# EAGLE design AQ_sensor_GSM (EAGLE 9.6.2)

## Sheet 1 of 6: Control Board
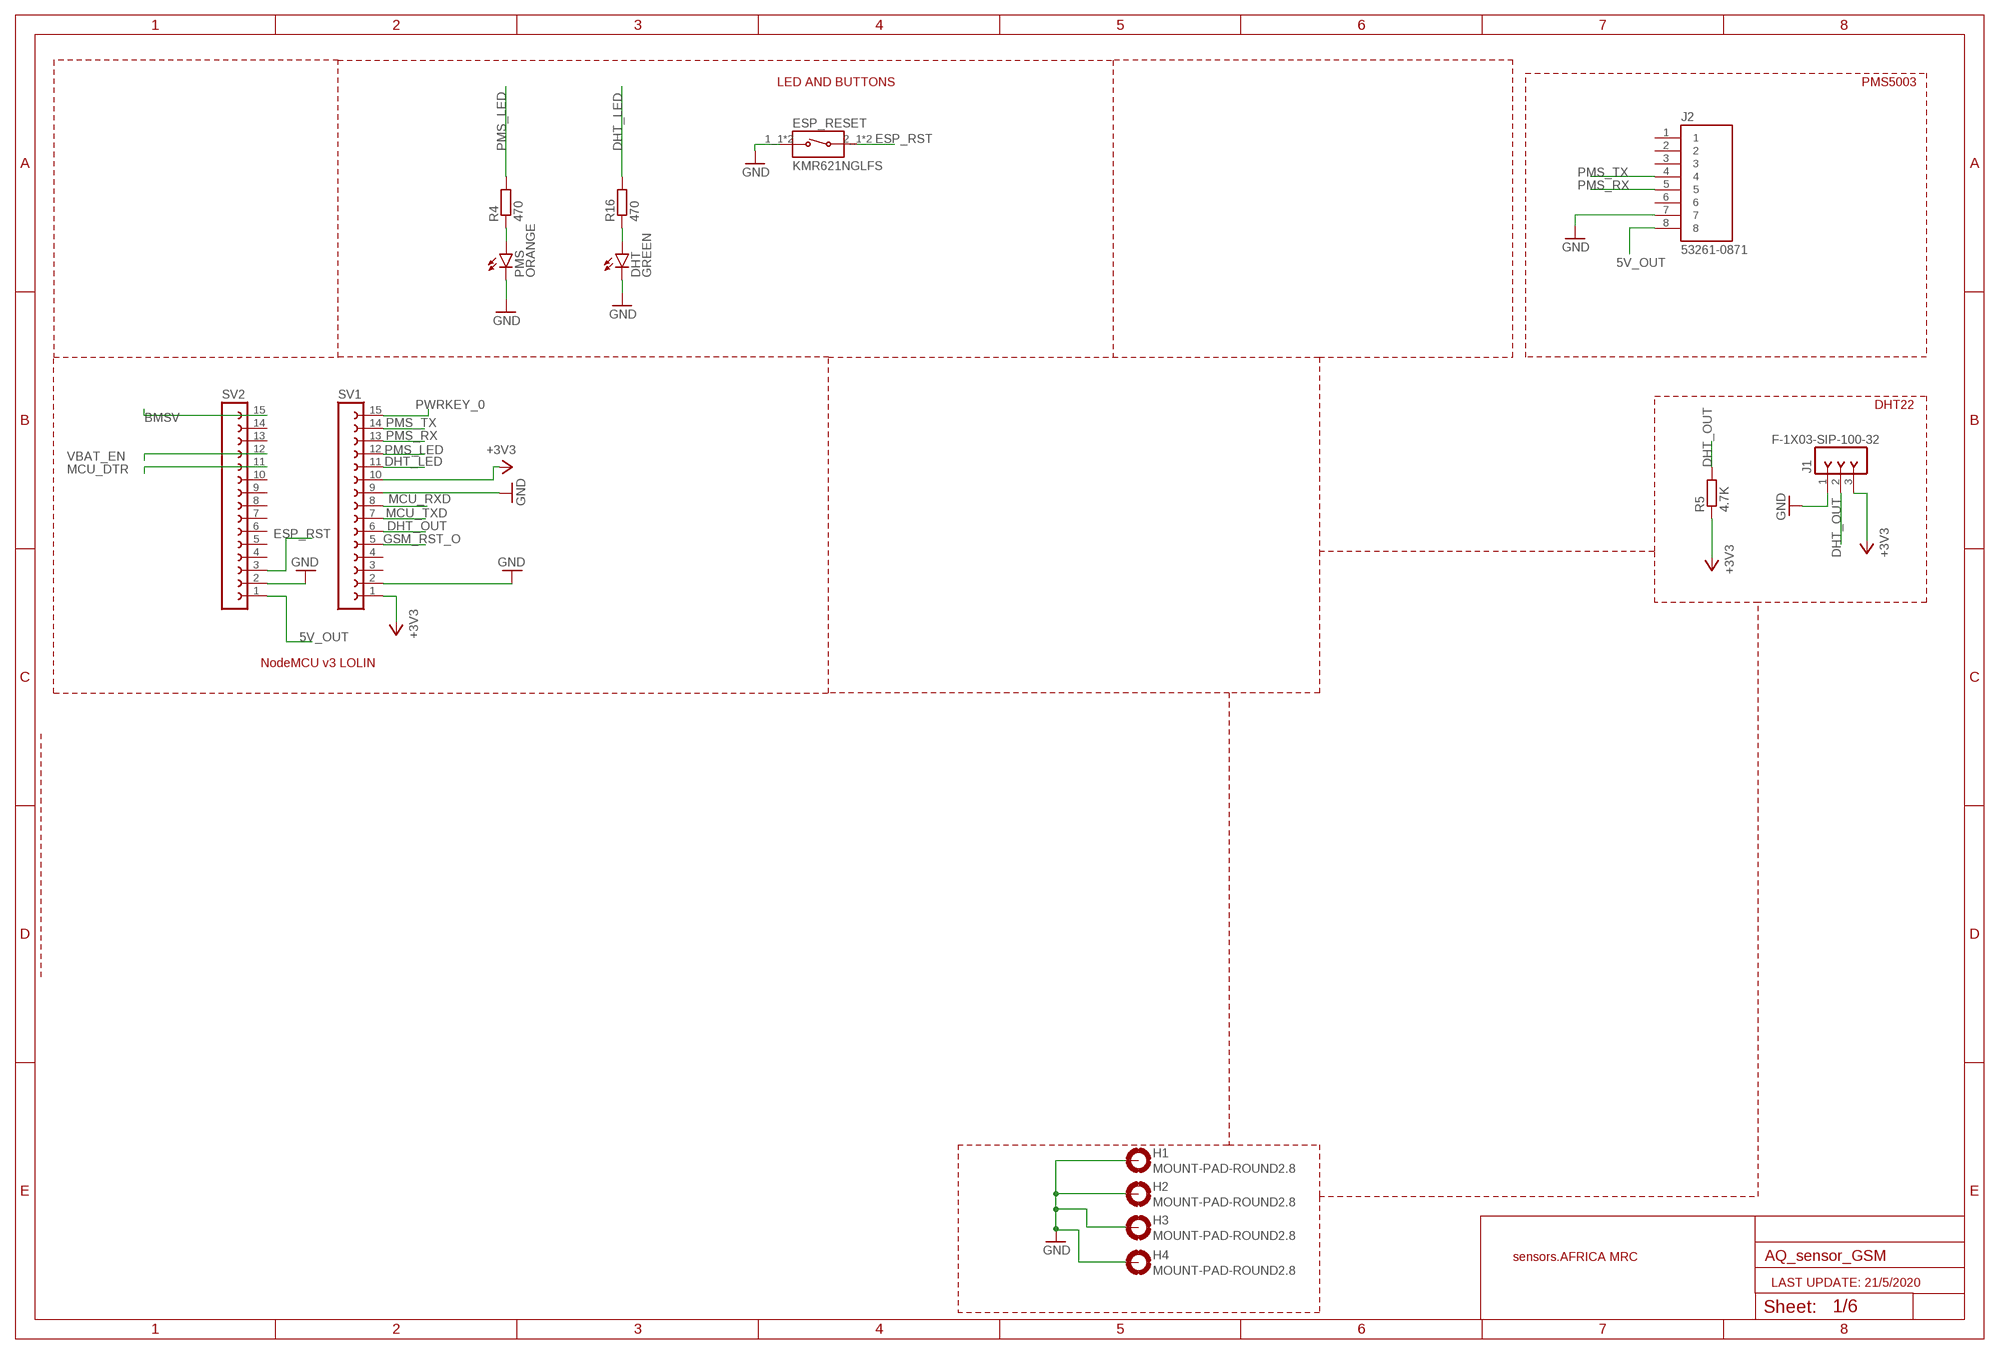
[diagram p0: schematic, sheet 1]

### Parts
DHT  GREEN  LEDCHIP-LED0603  [CHIP-LED0603]
ESP_RESET  KMR621NGLFS  [SW_KMR621NGLFS]
H1  MOUNT-PAD-ROUND2.8  [2,8-PAD]
H2  MOUNT-PAD-ROUND2.8  [2,8-PAD]
H3  MOUNT-PAD-ROUND2.8  [2,8-PAD]
H4  MOUNT-PAD-ROUND2.8  [2,8-PAD]
J1  F-1X03-SIP-100-32  [SIP-100-03-32]
J2  53261-0871  [MOLEX_53261-0871]
PMS  ORANGE  LEDCHIP-LED0603  [CHIP-LED0603]
R4  470  R-EU_R0603  [R0603]
R5  4.7K  R-EU_R0603  [R0603]
R16  470  R-EU_R0603  [R0603]
SV1  FE15-1  [FE15]
SV2  FE15-1  [FE15]

### Nets
5V_OUT [HCurrent]: J2.8 SV2.1 ; also sheet 4
+3V3 [POWER]: J1.3 R5.1 SV1.1 SV1.10 ; also sheet 2,4
BMSV: SV2.15 ; also sheet 4
DHT_LED: R16.2 SV1.11
DHT_OUT: J1.2 R5.2 SV1.6
ESP_RST: ESP_RESET.2_1 ESP_RESET.2_2 SV2.3
GND: DHT.C ESP_RESET.1_1 ESP_RESET.1_2 H1.B2,8(MOUNT) H2.B2,8(MOUNT) H3.B2,8(MOUNT) H4.B2,8(MOUNT) J1.1 J2.7 PMS.C SV1.2 SV1.9 SV2.2 ; also sheet 2,3,4,5
GSM_RST_O: SV1.5 ; also sheet 2
MCU_DTR: SV2.11 ; also sheet 2
MCU_RXD: SV1.8 ; also sheet 2,3
MCU_TXD: SV1.7 ; also sheet 2,3
N$4: PMS.A R4.1
N$27: DHT.A R16.1
PMS_LED: R4.2 SV1.12
PMS_RX: J2.5 SV1.13
PMS_TX: J2.4 SV1.14
PWRKEY_0: SV1.15 ; also sheet 2
VBAT_EN: SV2.12
Unconnected: J2.1 J2.2 J2.3 J2.6 SV1.3 SV1.4 SV2.4 SV2.5 SV2.6 SV2.7 SV2.8 SV2.9 SV2.10 SV2.13 SV2.14

### Notes on the sheet
- LED AND BUTTONS | PMS5003
- DHT22
- NodeMCU v3 LOLIN
- sensors.AFRICA MRC
- LAST UPDATE: 21/5/2020

## Sheet 2 of 6: Protection and Logic Level Converters
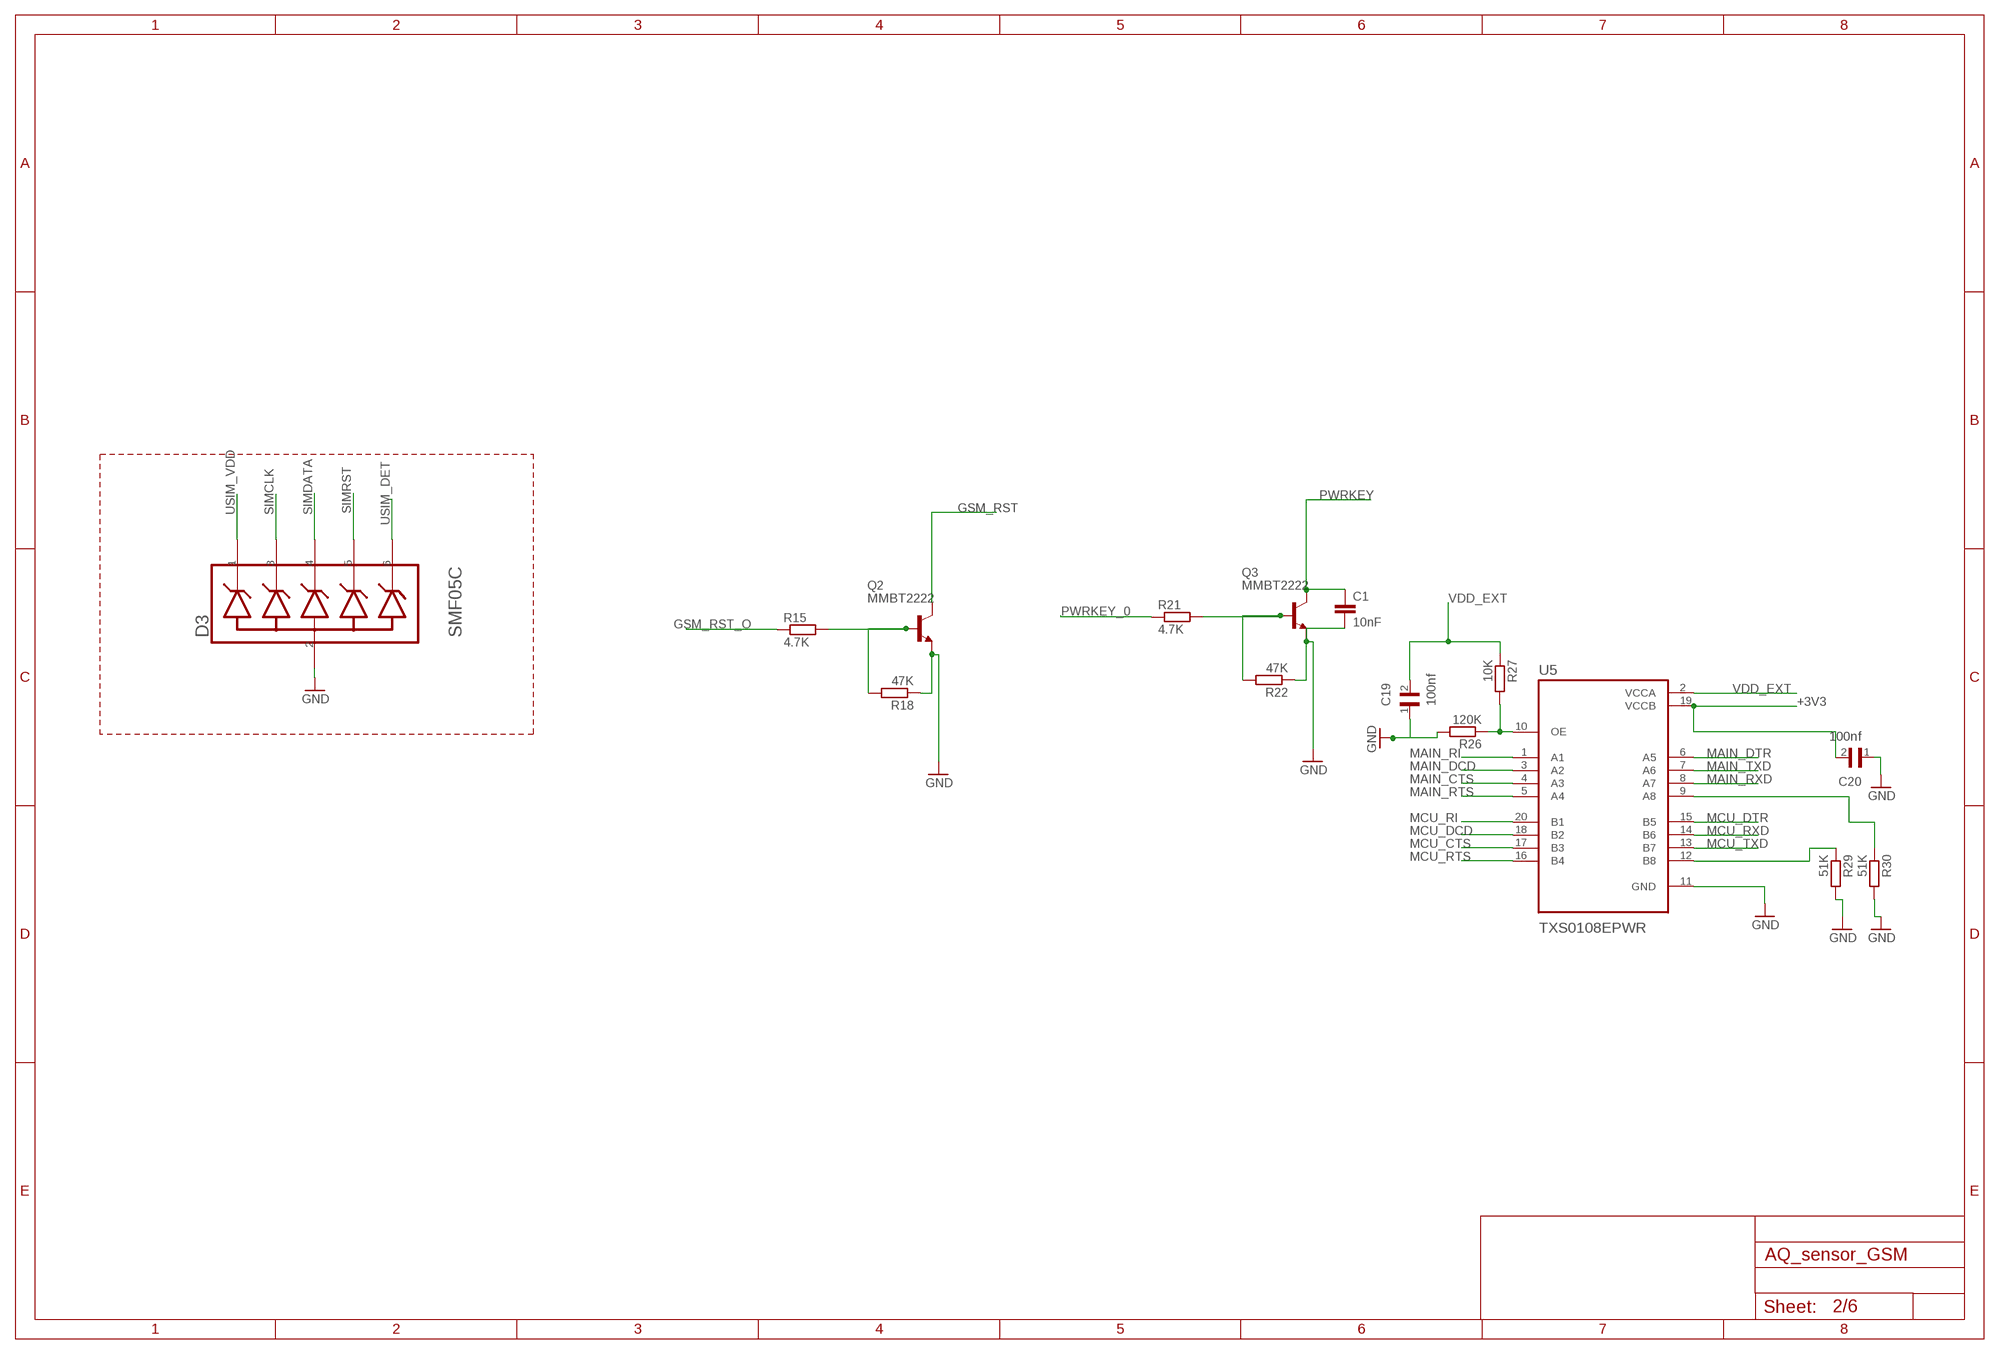
[diagram p1: schematic, sheet 2]

### Parts
C1  10nF  10NF-0603-50V-10%  [0603]
C19  100nf  06035C104K4T2A  [CAPC1608X90N]
C20  100nf  06035C104K4T2A  [CAPC1608X90N]
D3  SEMTECH_SMF05CSEMTECH_SMF05C_0_0  [SEMTECH_SMF05C_0]
Q2  MMBT2222  [SOT23-BEC]
Q3  MMBT2222  [SOT23-BEC]
R15  4.7K  R-EU_R0603  [R0603]
R18  47K  R-EU_R0603  [R0603]
R21  4.7K  R-EU_R0603  [R0603]
R22  47K  R-EU_R0603  [R0603]
R26  120K  R-EU_R0603  [R0603]
R27  10K  R-EU_R0603  [R0603]
R29  51K  R-EU_R0603  [R0603]
R30  51K  R-EU_R0603  [R0603]
U5  TXS0108EPWR  [SOP65P640X120-20N]

### Nets
+3V3 [POWER]: C20.2 U5.19(VCCB) ; also sheet 1,4
GND: C1.2 C19.1 C20.1 D3.2(ANODE) Q2.E Q3.E R18.1 R22.1 R26.2 R29.2 R30.2 U5.11(GND) ; also sheet 1,3,4,5
GSM_RST [BGA]: Q2.C ; also sheet 3,5
GSM_RST_O: R15.1 ; also sheet 1
MAIN_CTS: U5.4(A3) ; also sheet 3
MAIN_DCD: U5.3(A2) ; also sheet 3
MAIN_DTR: U5.6(A5) ; also sheet 3
MAIN_RI [BGA]: U5.1(A1) ; also sheet 3,5
MAIN_RTS: U5.5(A4) ; also sheet 3
MAIN_RXD: U5.8(A7) ; also sheet 3
MAIN_TXD: U5.7(A6) ; also sheet 3
MCU_CTS: U5.17(B3)
MCU_DCD: U5.18(B2)
MCU_DTR: U5.15(B5) ; also sheet 1
MCU_RI: U5.20(B1)
MCU_RTS: U5.16(B4)
MCU_RXD: U5.14(B6) ; also sheet 1,3
MCU_TXD: U5.13(B7) ; also sheet 1,3
N$1: Q2.B R15.2 R18.2
N$2: Q3.B R21.2 R22.2
N$31: R26.1 R27.2 U5.10(OE)
N$40: R30.1 U5.9(A8)
N$41: R29.1 U5.12(B8)
PWRKEY [BGA]: C1.1 Q3.C ; also sheet 3
PWRKEY_0: R21.1 ; also sheet 1
SIMCLK [BGA]: D3.3(2_CATHODE) ; also sheet 3
SIMDATA: D3.4(3_CATHODE) ; also sheet 3
SIMRST: D3.5(4_CATHODE) ; also sheet 3
USIM_DET: D3.6(5_CATHODE) ; also sheet 3
USIM_VDD: D3.1(1_CATHODE) ; also sheet 3
VDD_EXT: C19.2 R27.1 U5.2(VCCA) ; also sheet 3

## Sheet 3 of 6: GSM
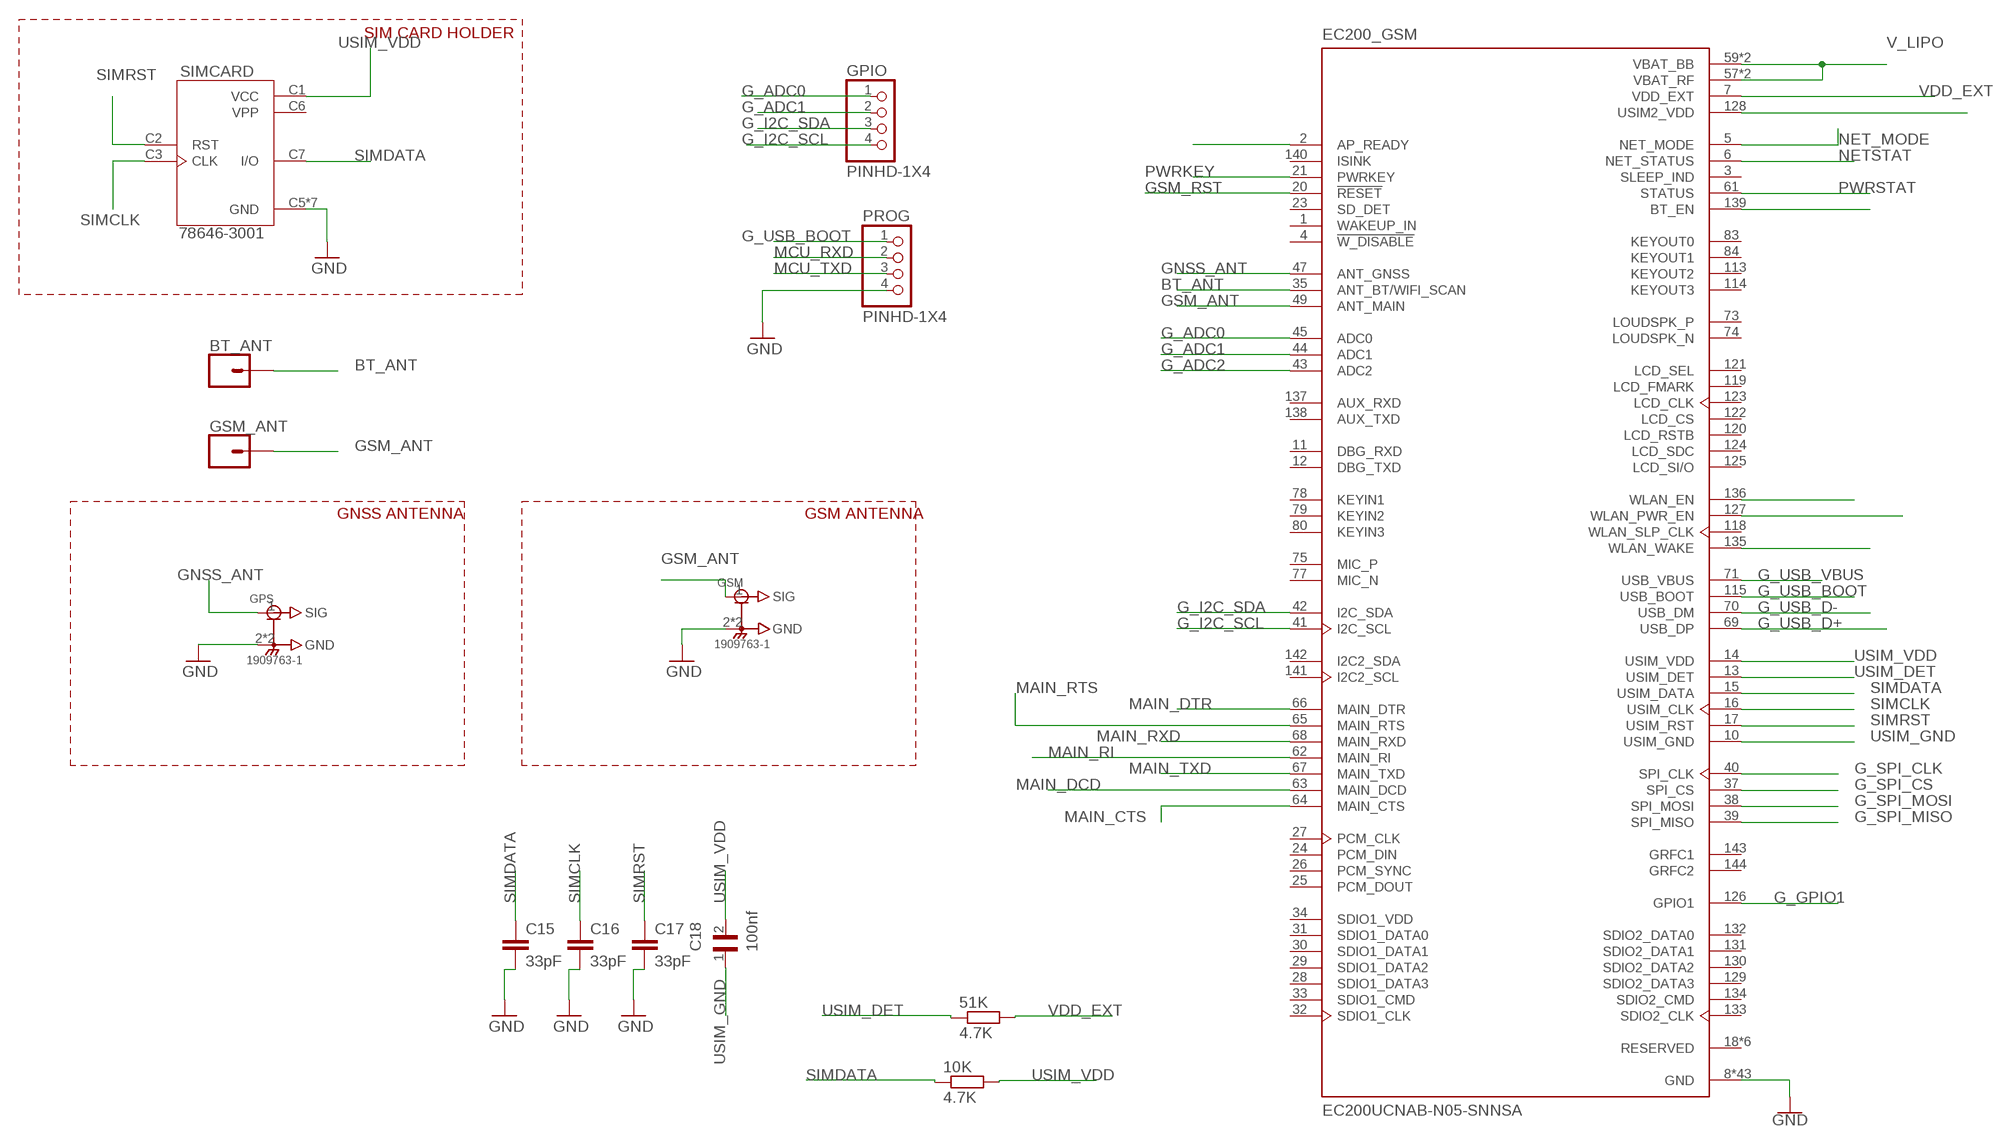
[diagram p2: schematic, sheet 3]

### Parts
10K  4.7K  R-EU_R0603  [R0603]
51K  4.7K  R-EU_R0603  [R0603]
BT_ANT  CONN_01  [1X01]
C15  33pF  C-EUC0603  [C0603]
C16  33pF  C-EUC0603  [C0603]
C17  33pF  C-EUC0603  [C0603]
C18  100nf  06035C104K4T2A  [CAPC1608X90N]
EC200_GSM  EC200UCNAB-N05-SNNSA  [XCVR_EC200UCNAB-N05-SNNSA]
GPIO  PINHD-1X4  [1X04]
GPS  1909763-1  [TE_1909763-1]
GSM  1909763-1  [TE_1909763-1]
GSM_ANT  CONN_01  [1X01]
PROG  PINHD-1X4  [1X04]
SIMCARD  78646-3001  [MOLEX_78646-3001]

### Nets
BT_ANT [HCurrent]: BT_ANT.1 EC200_GSM.35(ANT_BT/WIFI_SCAN)
G_ADC0: EC200_GSM.45(ADC0) GPIO.1
G_ADC1: EC200_GSM.44(ADC1) GPIO.2
G_ADC2: EC200_GSM.43(ADC2)
G_GPIO1: EC200_GSM.126(GPIO1)
G_I2C_SCL: EC200_GSM.41(I2C_SCL) GPIO.4
G_I2C_SDA: EC200_GSM.42(I2C_SDA) GPIO.3
G_SPI_CLK: EC200_GSM.40(SPI_CLK)
G_SPI_CS: EC200_GSM.37(SPI_CS)
G_SPI_MISO: EC200_GSM.39(SPI_MISO)
G_SPI_MOSI: EC200_GSM.38(SPI_MOSI)
G_USB_BOOT: EC200_GSM.115(USB_BOOT) PROG.1
G_USB_D+: EC200_GSM.69(USB_DP) ; also sheet 4
G_USB_D-: EC200_GSM.70(USB_DM) ; also sheet 4
G_USB_VBUS: EC200_GSM.71(USB_VBUS)
GND: C15.2 C16.2 C17.2 EC200_GSM.8(GND) EC200_GSM.9(GND) EC200_GSM.19(GND) EC200_GSM.22(GND) EC200_GSM.36(GND) EC200_GSM.46(GND) EC200_GSM.48(GND) EC200_GSM.50(GND) EC200_GSM.51(GND) EC200_GSM.52(GND) EC200_GSM.53(GND) EC200_GSM.54(GND) EC200_GSM.56(GND) EC200_GSM.72(GND) EC200_GSM.76(GND) EC200_GSM.85(GND) EC200_GSM.86(GND) EC200_GSM.87(GND) EC200_GSM.88(GND) EC200_GSM.89(GND) EC200_GSM.90(GND) EC200_GSM.91(GND) EC200_GSM.92(GND) EC200_GSM.93(GND) EC200_GSM.94(GND) EC200_GSM.95(GND) EC200_GSM.96(GND) EC200_GSM.97(GND) EC200_GSM.98(GND) EC200_GSM.99(GND) EC200_GSM.100(GND) EC200_GSM.101(GND) EC200_GSM.102(GND) EC200_GSM.103(GND) EC200_GSM.104(GND) EC200_GSM.105(GND) EC200_GSM.106(GND) EC200_GSM.107(GND) EC200_GSM.108(GND) EC200_GSM.109(GND) EC200_GSM.110(GND) EC200_GSM.111(GND) EC200_GSM.112(GND) GPS.2(GND) GPS.3(GND) GSM.2(GND) GSM.3(GND) PROG.4 SIMCARD.C5(GND) SIMCARD.G1(GND) SIMCARD.G2(GND) SIMCARD.G3(GND) SIMCARD.G4(GND) SIMCARD.G5(GND) SIMCARD.G6(GND) ; also sheet 1,2,4,5
GNSS_ANT [HCurrent]: EC200_GSM.47(ANT_GNSS) GPS.1(SIG)
GSM_ANT [HCurrent]: EC200_GSM.49(ANT_MAIN) GSM.1(SIG) GSM_ANT.1
GSM_RST [BGA]: EC200_GSM.20(!RESET) ; also sheet 2,5
MAIN_CTS: EC200_GSM.64(MAIN_CTS) ; also sheet 2
MAIN_DCD: EC200_GSM.63(MAIN_DCD) ; also sheet 2
MAIN_DTR: EC200_GSM.66(MAIN_DTR) ; also sheet 2
MAIN_RI [BGA]: EC200_GSM.62(MAIN_RI) ; also sheet 2,5
MAIN_RTS: EC200_GSM.65(MAIN_RTS) ; also sheet 2
MAIN_RXD: EC200_GSM.68(MAIN_RXD) ; also sheet 2
MAIN_TXD: EC200_GSM.67(MAIN_TXD) ; also sheet 2
MCU_RXD: PROG.2 ; also sheet 1,2
MCU_TXD: PROG.3 ; also sheet 1,2
N$5: EC200_GSM.128(USIM2_VDD)
N$7: EC200_GSM.139(BT_EN)
N$8: EC200_GSM.136(WLAN_EN)
N$15: EC200_GSM.127(WLAN_PWR_EN)
N$16: EC200_GSM.135(WLAN_WAKE)
N$23: EC200_GSM.2(AP_READY)
NET_MODE: EC200_GSM.5(NET_MODE) ; also sheet 5
NETSTAT [BGA]: EC200_GSM.6(NET_STATUS) ; also sheet 5
PWRKEY [BGA]: EC200_GSM.21(PWRKEY) ; also sheet 2
PWRSTAT: EC200_GSM.61(STATUS) ; also sheet 5
SIMCLK [BGA]: C16.1 EC200_GSM.16(USIM_CLK) SIMCARD.C3(CLK) ; also sheet 2
SIMDATA: 10K.1 C15.1 EC200_GSM.15(USIM_DATA) SIMCARD.C7(I/O) ; also sheet 2
SIMRST: C17.1 EC200_GSM.17(USIM_RST) SIMCARD.C2(RST) ; also sheet 2
USIM_DET: 51K.1 EC200_GSM.13(USIM_DET) ; also sheet 2
USIM_GND: C18.1 EC200_GSM.10(USIM_GND)
USIM_VDD: 10K.2 C18.2 EC200_GSM.14(USIM_VDD) SIMCARD.C1(VCC) ; also sheet 2
V_LIPO [HCurrent]: EC200_GSM.57(VBAT_RF) EC200_GSM.58(VBAT_RF) EC200_GSM.59(VBAT_BB) EC200_GSM.60(VBAT_BB) ; also sheet 4,5
VDD_EXT: 51K.2 EC200_GSM.7(VDD_EXT) ; also sheet 2
Unconnected: EC200_GSM.1(WAKEUP_IN) EC200_GSM.3(SLEEP_IND) EC200_GSM.4(!W_DISABLE) EC200_GSM.11(DBG_RXD) EC200_GSM.12(DBG_TXD) EC200_GSM.18(RESERVED) EC200_GSM.23(SD_DET) EC200_GSM.24(PCM_DIN) EC200_GSM.25(PCM_DOUT) EC200_GSM.26(PCM_SYNC) EC200_GSM.27(PCM_CLK) EC200_GSM.28(SDIO1_DATA3) EC200_GSM.29(SDIO1_DATA2) EC200_GSM.30(SDIO1_DATA1) EC200_GSM.31(SDIO1_DATA0) EC200_GSM.32(SDIO1_CLK) EC200_GSM.33(SDIO1_CMD) EC200_GSM.55(RESERVED) EC200_GSM.73(LOUDSPK_P) EC200_GSM.74(LOUDSPK_N) EC200_GSM.75(MIC_P) EC200_GSM.77(MIC_N) EC200_GSM.78(KEYIN1) EC200_GSM.79(KEYIN2) EC200_GSM.80(KEYIN3) EC200_GSM.81(RESERVED) EC200_GSM.82(RESERVED) EC200_GSM.83(KEYOUT0) EC200_GSM.84(KEYOUT1) EC200_GSM.113(KEYOUT2) EC200_GSM.114(KEYOUT3) EC200_GSM.116(RESERVED) EC200_GSM.117(RESERVED) EC200_GSM.118(WLAN_SLP_CLK) EC200_GSM.119(LCD_FMARK) EC200_GSM.120(LCD_RSTB) EC200_GSM.121(LCD_SEL) EC200_GSM.122(LCD_CS) EC200_GSM.123(LCD_CLK) EC200_GSM.124(LCD_SDC) EC200_GSM.125(LCD_SI/O) EC200_GSM.129(SDIO2_DATA3) EC200_GSM.130(SDIO2_DATA2) EC200_GSM.131(SDIO2_DATA1) EC200_GSM.132(SDIO2_DATA0) EC200_GSM.133(SDIO2_CLK) EC200_GSM.134(SDIO2_CMD) EC200_GSM.137(AUX_RXD) EC200_GSM.138(AUX_TXD) EC200_GSM.140(ISINK) EC200_GSM.141(I2C2_SCL) EC200_GSM.142(I2C2_SDA) EC200_GSM.143(GRFC1) EC200_GSM.144(GRFC2)

### Notes on the sheet
- SIM CARD HOLDER
- GNSS ANTENNA | GSM ANTENNA

## Sheet 4 of 6: POWER CIRCUIT
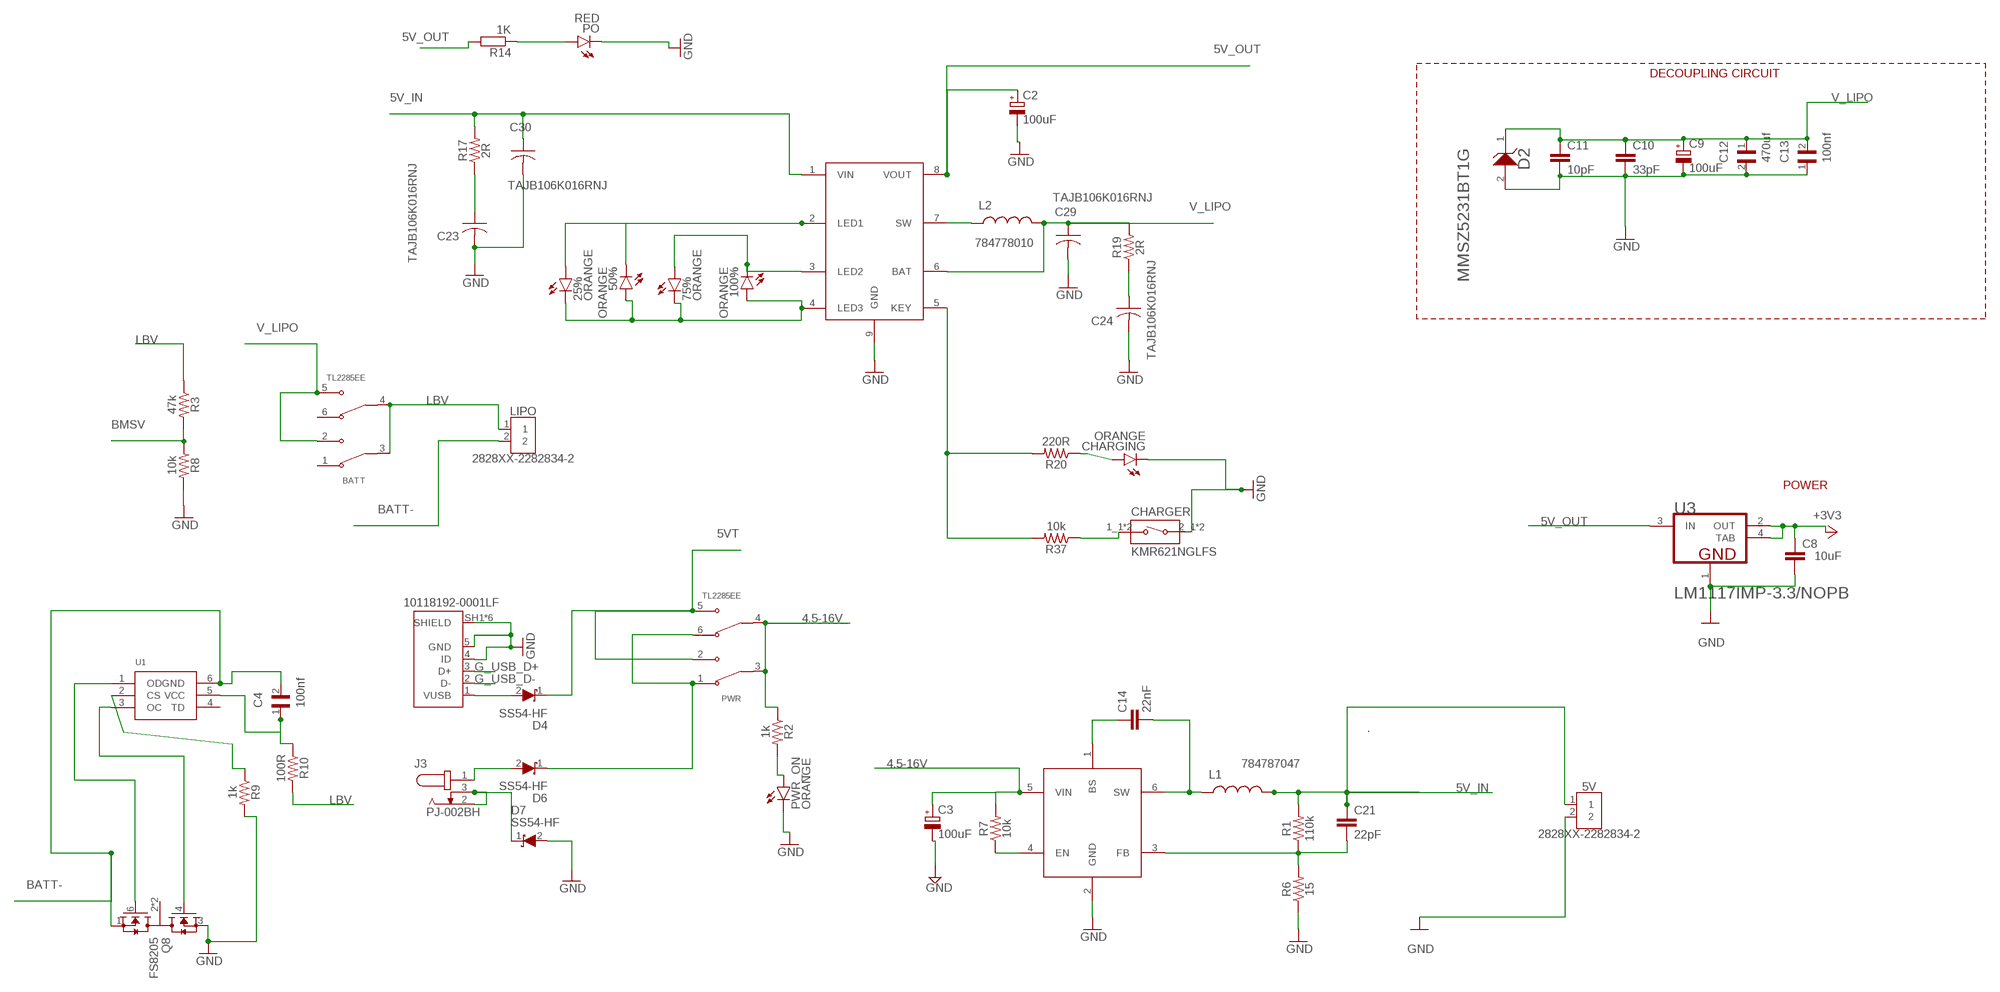
[diagram p3: schematic, sheet 4]

### Parts
5V  2828XX-2282834-2  [TERMBLK_254-2N]
25%  ORANGE  LEDCHIP-LED0603  [CHIP-LED0603]
50%  ORANGE  LEDCHIP-LED0603  [CHIP-LED0603]
75%  ORANGE  LEDCHIP-LED0603  [CHIP-LED0603]
100%  ORANGE  LEDCHIP-LED0603  [CHIP-LED0603]
BATT  TL2285EE  [SW_TL2285EE]
C2  100uF  CPOL-EUD  [PANASONIC_D]
C3  100uF  CPOL-EUD  [PANASONIC_D]
C4  100nf  06035C104K4T2A  [CAPC1608X90N]
C8  10uF  C-EUC0603  [C0603]
C9  100uF  CPOL-EUD  [PANASONIC_D]
C10  33pF  C-EUC0603  [C0603]
C11  10pF  C-EUC0603  [C0603]
C12  470uf  T495X477K010ATE100  [CAPMP7343X430N]
C13  100nf  06035C104K4T2A  [CAPC1608X90N]
C14  22nF  220PF-0402T-50V-5%  [0402-TIGHT]
C21  22pF  220PF-0402T-50V-5%  [0402-TIGHT]
C23  TAJB106K016RNJ  [CAP_TANT_B]
C24  TAJB106K016RNJ  [CAP_TANT_B]
C29  TAJB106K016RNJ  [CAP_TANT_B]
C30  TAJB106K016RNJ  [CAP_TANT_B]
CHARGER  KMR621NGLFS  [SW_KMR621NGLFS]
CHARGING  ORANGE  LEDCHIP-LED0603  [CHIP-LED0603]
D2  ON_SEMICONDUCTOR_MMSZ5231BT1GON_SEMICONDUCTOR_MMSZ5231BT1G_0_0  [ON_SEMICONDUCTOR_MMSZ5231BT1G_0]
D4  SS54-HF  [DIOM5025X220N]
D6  SS54-HF  [DIOM5025X220N]
D7  SS54-HF  [DIOM5025X220N]
J3  PJ-002BH  [CUI_PJ-002BH]
L1  784787047  [784787047]
L2  784778010  [784778010]
LIPO  2828XX-2282834-2  [TERMBLK_254-2N]
MT2492  MT2492  MT2492MT2492  [SOT95P280X145-6N]
PB_IN  10118192-0001LF  [AMPHENOL_10118192-0001LF]
PO  RED  LEDCHIP-LED0603  [CHIP-LED0603]
PWR  TL2285EE  [SW_TL2285EE]
PWR_ON  ORANGE  LEDCHIP-LED0603  [CHIP-LED0603]
Q8  FS8205  [SOT95P280X145-6N]
R1  110k  1.20KOHM-0603-1/10W-1%  [0603]
R2  1k  1.20KOHM-0603-1/10W-1%  [0603]
R3  47k  1.20KOHM-0603-1/10W-1%  [0603]
R6  15  1.20KOHM-0603-1/10W-1%  [0603]
R7  10k  1.20KOHM-0603-1/10W-1%  [0603]
R8  10k  1.20KOHM-0603-1/10W-1%  [0603]
R9  1k  1.20KOHM-0603-1/10W-1%  [0603]
R10  100R  1.20KOHM-0603-1/10W-1%  [0603]
R14  1K  R-EU_R0603  [R0603]
R17  2R  1.20KOHM-0603-1/10W-1%  [0603]
R19  2R  1.20KOHM-0603-1/10W-1%  [0603]
R20  220R  1.20KOHM-0603-1/10W-1%  [0603]
R37  10k  1.20KOHM-0603-1/10W-1%  [0603]
U1  DW01-P  [SOT23-6L]
U3  TEXAS_INSTRUMENTS_LM1117IMP-3.3-NOPBTEXAS_INSTRUMENTS_LM1117IMP-3.3-NOPB_0_0  [TEXAS_INSTRUMENTS_LM1117IMP-3.3-NOPB_0]
U$2  IP5306IP5306  [SOIC127P600X165-9T209N]

### Nets
4.5-16V [HCurrent]: C3.+ MT2492.5(VIN) PWR.3(COM1) PWR.4(COM2) R2.1 R7.2
5V_IN [HCurrent]: 5V.1 C21.1 C30.1 L1.2 R1.2 R17.2 U$2.1(VIN)
5V_OUT [HCurrent]: C2.+ R14.2 U3.3(IN) U$2.8(VOUT) ; also sheet 1
5VT [HCurrent]: D4.1(K) PWR.2(NO1) PWR.5(NO2)
+3V3 [POWER]: C8.1 U3.2(OUT) U3.4(TAB) ; also sheet 1,2
BATT- [HCurrent]: C4.2 LIPO.2 Q8.1(S1) U1.6(GND)
BMSV: R3.2 R8.1 ; also sheet 1
G_USB_D+: PB_IN.3(D+) ; also sheet 3
G_USB_D-: PB_IN.2(D-) ; also sheet 3
GND: 5V.2 C2.- C3.- C8.2 C9.- C10.2 C11.2 C12.2 C13.1 C23.2 C24.2 C29.2 C30.2 CHARGER.2_1 CHARGER.2_2 CHARGING.C D2.2(A) D7.2(A) MT2492.2(GND) PB_IN.4(ID) PB_IN.5(GND) PB_IN.SH1(SHIELD) PB_IN.SH2(SHIELD) PB_IN.SH3(SHIELD) PB_IN.SH4(SHIELD) PB_IN.SH5(SHIELD) PB_IN.SH6(SHIELD) PO.C PWR_ON.C Q8.3(S2) R6.1 R8.2 R9.2 U3.1(GND) U$2.9(GND) ; also sheet 1,2,3,5
LBV [HCurrent]: BATT.3(COM1) BATT.4(COM2) LIPO.1 R3.1 R10.2
N$3: C14.1 MT2492.1(BS)
N$6: C14.2 L1.1 MT2492.6(SW)
N$9: Q8.6(G1) U1.1(OD)
N$10: C21.2 MT2492.3(FB) R1.1 R6.2
N$11: MT2492.4(EN) R7.1
N$13: C23.1 R17.1
N$14: 25%.C 50%.A 75%.C 100%.A U$2.4(LED3)
N$17: 25%.A 50%.C U$2.2(LED1)
N$18: 75%.A 100%.C U$2.3(LED2)
N$19: Q8.4(G2) U1.3(OC)
N$20: CHARGER.1_1 CHARGER.1_2 R37.1
N$21: L2.1 U$2.7(SW)
N$24: C24.1 R19.1
N$25: PO.A R14.1
N$35: PWR_ON.A R2.2
N$37: C4.1 R10.1 U1.5(VCC)
N$45: R20.2 R37.2 U$2.5(KEY)
N$46: CHARGING.A R20.1
N$47: R9.1 U1.2(CS)
N$59: D4.2(A) PB_IN.1(VUSB)
N$60: D7.1(K) J3.2 J3.3
N$61: D6.2(A) J3.1
V_LIPO [HCurrent]: BATT.2(NO1) BATT.5(NO2) C9.+ C10.1 C11.1 C12.1 C13.2 C29.1 D2.1(K) L2.2 R19.2 U$2.6(BAT) ; also sheet 3,5
VUSB [HCurrent]: D6.1(K) PWR.1(NC1) PWR.6(NC2)
Unconnected: BATT.1(NC1) BATT.6(NC2) Q8.2(D12) Q8.5(D12) U1.4(TD)

### Notes on the sheet
- DECOUPLING CIRCUIT
- POWER

## Sheet 5 of 6: LEDs and Buttons
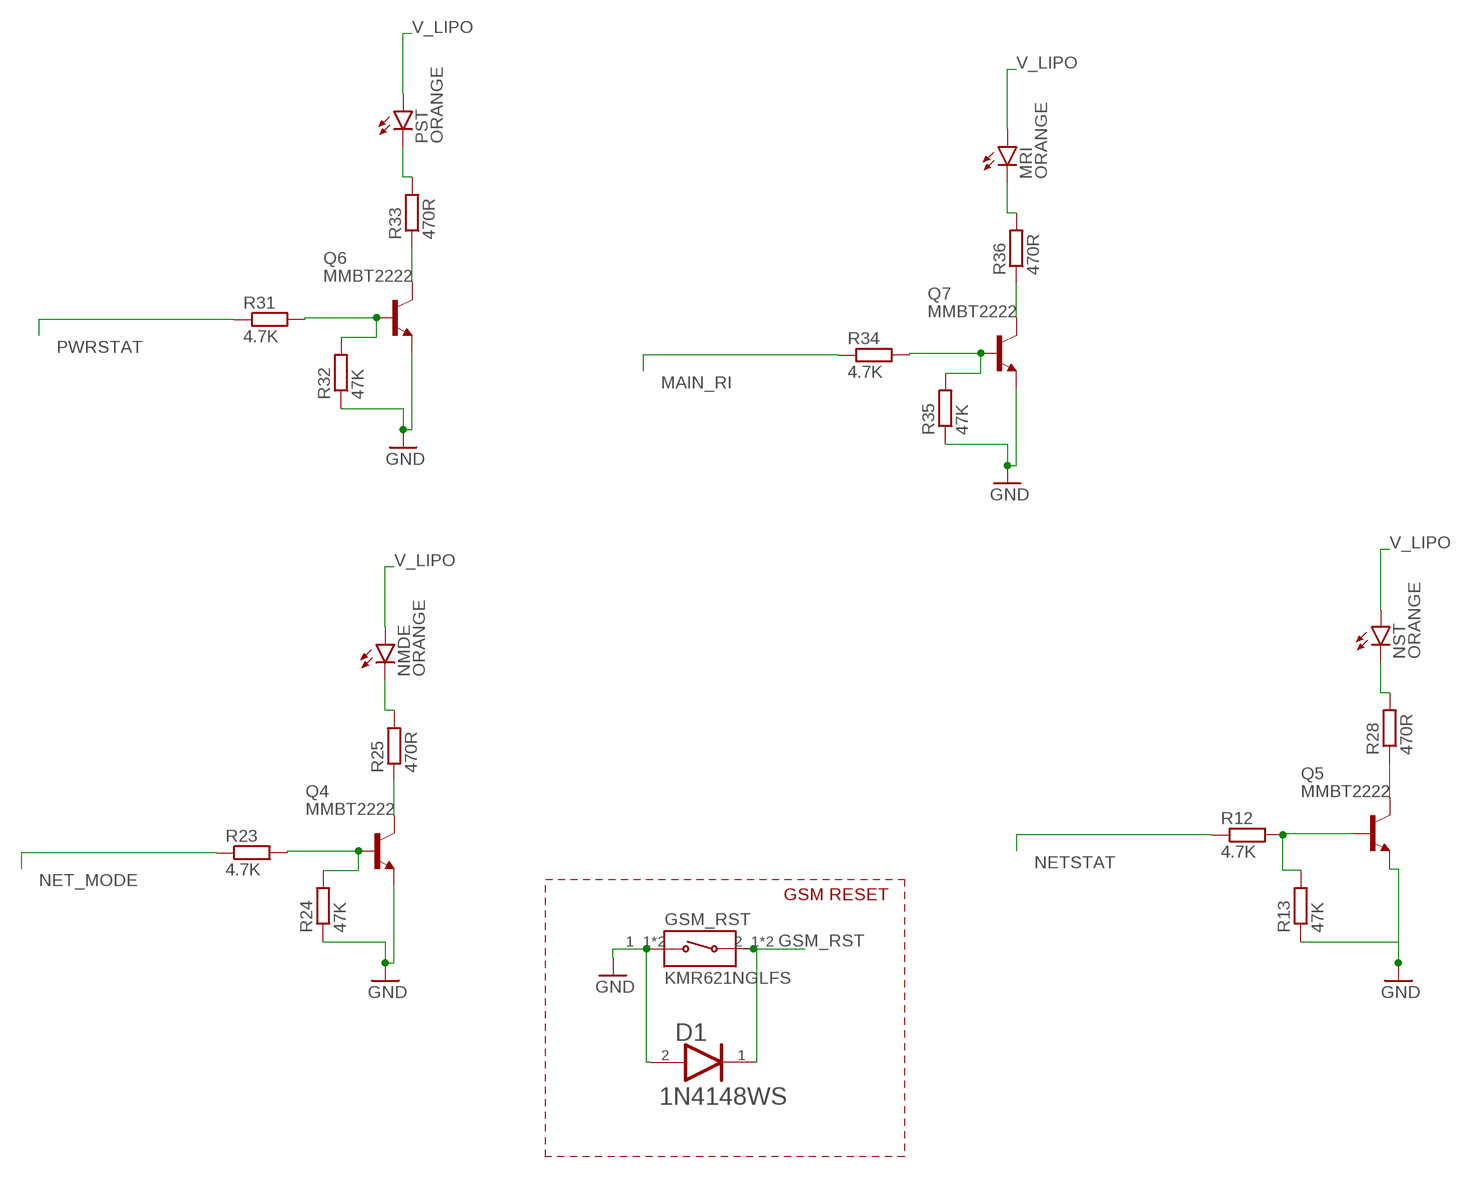
[diagram p4: schematic, sheet 5]

### Parts
D1  ON_SEMI_1N4148WSON_SEMI_1N4148WS_0_0  [ON_SEMI_1N4148WS_0]
GSM_RST  KMR621NGLFS  [SW_KMR621NGLFS]
MRI  ORANGE  LEDCHIP-LED0603  [CHIP-LED0603]
NMDE  ORANGE  LEDCHIP-LED0603  [CHIP-LED0603]
NST  ORANGE  LEDCHIP-LED0603  [CHIP-LED0603]
PST  ORANGE  LEDCHIP-LED0603  [CHIP-LED0603]
Q4  MMBT2222  [SOT23-BEC]
Q5  MMBT2222  [SOT23-BEC]
Q6  MMBT2222  [SOT23-BEC]
Q7  MMBT2222  [SOT23-BEC]
R12  4.7K  R-EU_R0603  [R0603]
R13  47K  R-EU_R0603  [R0603]
R23  4.7K  R-EU_R0603  [R0603]
R24  47K  R-EU_R0603  [R0603]
R25  470R  R-EU_R0603  [R0603]
R28  470R  R-EU_R0603  [R0603]
R31  4.7K  R-EU_R0603  [R0603]
R32  47K  R-EU_R0603  [R0603]
R33  470R  R-EU_R0603  [R0603]
R34  4.7K  R-EU_R0603  [R0603]
R35  47K  R-EU_R0603  [R0603]
R36  470R  R-EU_R0603  [R0603]

### Nets
GND: D1.2(ANODE) GSM_RST.1_1 GSM_RST.1_2 Q4.E Q5.E Q6.E Q7.E R13.1 R24.1 R32.1 R35.1 ; also sheet 1,2,3,4
GSM_RST [BGA]: D1.1(CATHODE) GSM_RST.2_1 GSM_RST.2_2 ; also sheet 2,3
MAIN_RI [BGA]: R34.1 ; also sheet 2,3
N$22: Q5.B R12.2 R13.2
N$26: Q4.B R23.2 R24.2
N$28: Q6.B R31.2 R32.2
N$29: Q4.C R25.1
N$30: NMDE.C R25.2
N$32: Q6.C R33.1
N$33: Q5.C R28.1
N$34: NST.C R28.2
N$39: PST.C R33.2
N$42: Q7.B R34.2 R35.2
N$43: Q7.C R36.1
N$44: MRI.C R36.2
NET_MODE: R23.1 ; also sheet 3
NETSTAT [BGA]: R12.1 ; also sheet 3
PWRSTAT: R31.1 ; also sheet 3
V_LIPO [HCurrent]: MRI.A NMDE.A NST.A PST.A ; also sheet 3,4

### Notes on the sheet
- GSM RESET

## Sheet 6 of 6: SD Card

## Power pins joined to a net without a drawn wire
SDIO1_VDD: EC200_GSM.34(SDIO1_VDD)
VPP: SIMCARD.C6(VPP)

## Library data of the parts
5V LIPO = Connector:2828XX-2: 2 Position Wire to Board Terminal Block Horizontal with Board Datasheet <https://www.te.com.cn/commerce/DocumentDelivery/DDEController?Action=showdoc&DocId=Catalog+Section%7F1308389_EUROSTYLE_TERMINAL_BLOCKS%7F0607%7Fpdf%7FEnglish%7FENG_CS_1308389_EUROSTYLE_TERMINAL_BLOCKS_0607.pdf%7F2-282837-5>; CATEGORY: Fixed Terminal Blocks; DESCRIPTION: Fixed Terminal Blocks 2P SIDE ENTRY 2.54mm; MANUFACTURER: TE Connectivity AMP Connectors; MPN: 282834-2; OPERATING_TEMPERATURE: -40°C ~ 105°C; PART_STATUS: Active; PITCH: 0.100" (2.54mm); ROHS_COMPLIANCE: RoHS Compliant; SERIES: Buchanan; SUBCATEGORY: Terminal Blocks; TYPE: Through Hole; Screw - Rising Cage Clamp; Side wire entry, Horizontal with Board
10K 51K R4 R5 R12-R16 R18 R21-R36 = rcl:R-EU_: RESISTOR, European symbol; SPICEPREFIX: R
25% 50% 75% 100% CHARGING DHT MRI NMDE NST PMS PO PST PWR_ON = led:LED: LED OSRAM: - CHIPLED LG R971, LG N971, LY N971, LG Q971, LY Q971, LO R971, LY R971 LH N974, LH R974 LS Q976, LO Q976, LY Q976 LO Q996 - Hyper CHIPLED LW Q18S LB Q993, LB Q99A, LB R99A - SideLED LS A670, LO A670, LY A670, LG A670, LP A670 LB A673, LV A673, LT A673, LW A673 LH A674 LY A675 LS A676, LA A676, LO A676, LY A676, LW A676 LS A679, LY A679, LG A679 - Hyper Micro SIDELED® LS Y876, LA Y876, LO Y876, LY Y876 LT Y87S - SmartLED LW L88C, LW L88S LB L89C, LB L89S, LG L890 LS L89K, LO L89K, LY L89K LS L896, LA L896, LO L896, LY L896 - TOPLED LS T670, LO T670, LY T670, LG T670, LP T670 LSG T670, LSP T670, LSY T670, LOP T670, LYG T670 LG T671, LOG T671, LSG T671 LB T673, LV T673, LT T673, LW T673 LH T674 LS T676, LA T676, LO T676, LY T676, LB T676, LH T676, LSB T676, LW T676 LB T67C, LV T67C, LT T67C, LS T67K, LO T67K, LY T67K, LW E67C LS E67B, LA E67B, LO E67B, LY E67B, LB E67C, LV E67C, LT E67C LW T67C LS T679, LY T679, LG T679 LS T770, LO T770, LY T770, LG T770, LP T770 LB T773, LV T773, LT T773, LW T773 LH T774 LS E675, LA E675, LY E675, LS T675 LS T776, LA T776, LO T776, LY T776, LB T776 LHGB T686 LT T68C, LB T68C - Hyper Mini TOPLED® LB M676 - Mini TOPLED Santana® LG M470 LS M47K, LO M47K, LY M47K Source: http://www.osram.convergy.de LUXEON: - LUMILED® LXK2-PW12-R00, LXK2-PW12-S00, LXK2-PW14-U00, LXK2-PW14-V00 LXK2-PM12-R00, LXK2-PM12-S00, LXK2-PM14-U00 LXK2-PE12-Q00, LXK2-PE12-R00, LXK2-PE12-S00, LXK2-PE14-T00, LXK2-PE14-U00 LXK2-PB12-K00, LXK2-PB12-L00, LXK2-PB12-M00, LXK2-PB14-N00, LXK2-PB14-P00, LXK2-PB14-Q00 LXK2-PR12-L00, LXK2-PR12-M00, LXK2-PR14-Q00, LXK2-PR14-R00 LXK2-PD12-Q00, LXK2-PD12-R00, LXK2-PD12-S00 LXK2-PH12-R00, LXK2-PH12-S00 LXK2-PL12-P00, LXK2-PL12-Q00, LXK2-PL12-R00 Source: www.luxeon.com KINGBRIGHT: KA-3528ASYC Source: www.kingbright.com
BATT PWR = TL2285EE:TL2285EE: Check availability <https://pricing.snapeda.com/parts/TL2285EE/E-Switch/view-part?ref=eda>; AVAILABILITY: In Stock; CHECK_PRICES: https://www.snapeda.com/parts/TL2285EE/E-Switch/view-part/?ref=eda; DESCRIPTION: Pushbutton Switch DPDT Standard Through Hole; MF: E-Switch; MP: TL2285EE; PACKAGE: None; PRICE: None; PURCHASE-URL: https://www.snapeda.com/api/url_track_click_mouser/?unipart_id=653295&manufacturer=E-Switch&part_name=TL2285EE&search_term= latching straight dpdt switch; SNAPEDA_LINK: https://www.snapeda.com/parts/TL2285EE/E-Switch/view-part/?ref=snap
BT_ANT GSM_ANT = SparkFun-Connectors:CONN_01: Single connection point. Often used as Generic Header-pin footprint for 0.1 inch spaced/style header connections On any of the 0.1 inch spaced packages, you can populate with these: Break Away Headers - Straight <https://www.sparkfun.com/products/116> (PRT-00116) Break Away Male Headers - Right Angle <https://www.sparkfun.com/products/553> (PRT-00553) Female Headers <https://www.sparkfun.com/products/115> (PRT-00115) Break Away Headers - Machine Pin <https://www.sparkfun.com/products/117> (PRT-00117) Break Away Female Headers - Swiss Machine Pin <https://www.sparkfun.com/products/743> (PRT-00743) This device is also useful as a general connection point to wire up your design to another part of your project. Our various solder wires solder well into these plated through hole pads. Hook-Up Wire - Assortment (Stranded, 22 AWG) <https://www.sparkfun.com/products/11375> (PRT-11375) Hook-Up Wire - Assortment (Solid Core, 22 AWG) <https://www.sparkfun.com/products/11367> (PRT-11367) View the entire wire category on our website here <https://www.sparkfun.com/categories/141> Special notes: SMTSO-256-ET is a "flush mount" nut for a 4-40 screw. We mostly use this on specialty testbeds; it is a nice way to connect hardware to your PCB at an adjustable hieght. Also note, the SNAP packages are for using a snappable style connector. We sell a baggie of snaps and they are also used on two LilyPad designs: Snap Assortment - 30 pack (male and female) <https://www.sparkfun.com/products/11347> (DEV-11347) LilyPad Arduino SimpleSnap <https://www.sparkfun.com/products/10941> (DEV-10941) LilyPad SimpleSnap Protoboard <https://www.sparkfun.com/products/10940> (DEV-10940)
C1 = SparkFun-Capacitors:10NF: 0.01uF/10nF/10,000pF ceramic capacitors A capacitor is a passive two-terminal electrical component used to store electrical energy temporarily in an electric field. CAP-09321; PROD_ID: CAP-00867
C2 C3 C9 = rcl:CPOL-EU: POLARIZED CAPACITOR, European symbol; SPICEPREFIX: C
C4 C13 C18-C20 = 06035C104K4T2A:06035C104K4T2A: Capacitor MLCC 0603 100nF 50V Check availability <https://pricing.snapeda.com/parts/06035C104K4T2A/AVX/view-part?ref=eda>; AVAILABILITY: In Stock; CHECK_PRICES: https://www.snapeda.com/parts/06035C104K4T2A/AVX+%252F+Kyocera/view-part/?ref=eda; DESCRIPTION: Capacitor MLCC 0603 100nF 50V | AVX 06035C104K4T2A; MF: AVX; MP: 06035C104K4T2A; PACKAGE: 1608 AVX; PRICE: None; SNAPEDA_LINK: https://www.snapeda.com/parts/06035C104K4T2A/AVX+%252F+Kyocera/view-part/?ref=snap
C8 C10 C11 C15-C17 = rcl:C-EU: CAPACITOR, European symbol; SPICEPREFIX: C
C12 = T495X477K010ATE100:T495X477K010ATE100: Tantalum capacitor [KEMET] T495X477K010ATE100 Tantalum capacitor Check availability <https://pricing.snapeda.com/parts/T495X477K010ATE100/KEMET/view-part?ref=eda>; AVAILABILITY: In Stock; CHECK_PRICES: https://www.snapeda.com/parts/T495X477K010ATE100/KEMET/view-part/?ref=eda; DESCRIPTION: 470uF Solid MnO2 Tantalum Electrolytic Capacitor, 10 V dc +/-10%, T495 Series | KEMET T495X477K010ATE100; MF: KEMET; MP: T495X477K010ATE100; PACKAGE: SMD-2 Kemet; PRICE: None; PURCHASE-URL: https://www.snapeda.com/api/url_track_click_mouser/?unipart_id=554043&manufacturer=KEMET&part_name=T495X477K010ATE100&search_term= 470uf 10v 100mω ±10% case-e-7343 tantalum capacitors rohs; SNAPEDA_LINK: https://www.snapeda.com/parts/T495X477K010ATE100/KEMET/view-part/?ref=snap
C14 C21 = SparkFun-Capacitors:220PF: 220pF/0.22nF ceramic capacitors A capacitor is a passive two-terminal electrical component used to store electrical energy temporarily in an electric field.; PROD_ID: CAP-15725; VALUE: 220pF
C23 C24 C29 C30 = Resistor_Capacitor:TAJB106K016RNJ: CAP TANT 10UF 10% 16V 1411 Manufacturer's datasheet <http://datasheets.avx.com/TAJ.pdf>; CREATED_BY: PCBLayout.com; DIGIKEY_PART_NUMBER: 478-1673-2-ND; MANUFACTURER: AVX Corporation; MPN: TAJB106K016RNJ; PACKAGE: CAP TANT B
CHARGER ESP_RESET GSM_RST = AQ_sensor_GSM:KMR621NGLFS: Tactile Switches 50mA 32VDC 1.9mmH 2N IP67; AVAILABILITY: Unavailable; DESCRIPTION: Tactile Switch SPST-NO Top Actuated Surface Mount; MF: C&K; MP: KMR621NG LFS; PACKAGE: None; PRICE: None
D1 = AQ_sensor_GSM:ON_SEMI_1N4148WS: Small Signal Diodes; CENTROID_NOT_SPECIFIED: No; DATASHEET: https://www.fairchildsemi.com/datasheets/1N/1N4148WS.pdf; DIGIKEY_DESCRIPTION: DIODE GEN PURP 75V 150MA SOD323F; DIGIKEY_PART_NUMBER: 1N4148WSFSCT-ND; IPC_LAND_PATTERN_NAME: SOD250125X70-2; LEAD_FREE: yes; MF: ON Semi; MFG_PACKAGE_IDENT: CASE 477AB; MOUSER_DESCRIPTION: Diodes - General Purpose, Power, Switching Small Signal Diode; MOUSER_PART_NUMBER: 512-1N4148WS; MPN: 1N4148WS; PACKAGE: SOD-323FL; PREFIX: D; ROHS: yes; TEMPERATURE_RANGE_HIGH: +150°C
D2 = AQ_sensor_GSM:ON_SEMICONDUCTOR_MMSZ5231BT1G: ONSC-K1A2-2; CIIVA_IDS: 804101; COMPONENT_LINK_1_DESCRIPTION: Manufacturer URL; COMPONENT_LINK_1_URL: http://www.onsemi.com/; COMPONENT_LINK_3_DESCRIPTION: Package Specification; COMPONENT_LINK_3_URL: http://www.onsemi.com/pub_link/Collateral/425-04.PDF; DATASHEET: http://www.onsemi.com/pub_link/Collateral/MMSZ5221BT1-D.PDF; DATASHEET_VERSION: Rev. 12; FOOTPRINT_VARIANT_NAME_0: Manufacturer Recommended; IMPORTED: yes; IMPORTED_FROM: vault; IMPORT_TS: 1521844429; MF: On Semiconductor; MOUNTING_TECHNOLOGY: Surface Mount; MPN: MMSZ5231BT1G; PACKAGE: SOD-123-2-425-04; PACKAGE_DESCRIPTION: 2-Pin SOD, Body 1.6 x 2.69 mm; PACKAGE_VERSION: Rev. G, 10/2009; PACKING: Tape and Reel; PREFIX: D; P_MAX_W: 0.5; RELEASE_DATE: 1407150685; ROHS: No; VAULT_GUID: 27F6BF34-1EB2-4973-A1B4-1410F52D084D; VAULT_REVISION: BBBB861B-93F7-43FE-93E6-D586C34E6C45; VZ_TYP_V: 5.1
D3 = AQ_sensor_GSM:SEMTECH_SMF05C: TVS Diode Array; CENTROID_NOT_SPECIFIED: No; DATASHEET: http://www.semtech.com/images/datasheet/smf05c.pdf; DIGIKEY_DESCRIPTION: DIODE TVS DIODE 5VWM 12.5VC SC70-6; DIGIKEY_PART_NUMBER: SMF05CCT-ND; JUNCTION_CAPACITANCE: 130pF max; LEAD_FREE: yes; MANUFACTURER_PRODUCT_PAGE: http://www.semtech.com/apps/product.php?pn=SMF05C; MF: Semtech; MFG_PACKAGE_IDENT: SC70-6L; MOUSER_PART_NUMBER: 947-SMF05C.TCT; MPN: SMF05C; PACKAGE: SC-70-6; PREFIX: D; REVERSE_STAND-OFF_VOLTAGE: 5V; ROHS: yes; TEMPERATURE_RANGE_HIGH: +125°C; TEMPERATURE_RANGE_LOW: -55°C
D4 D6 D7 = SS54-HF schottkey Diode:SS54-HF: DIODE SCHOTTKY 5A 40V SMA Source: Datasheet <https://componentsearchengine.com/Datasheets/1/SS54-HF.pdf> Check availability <https://pricing.snapeda.com/parts/SS54-HF/Comchip%20Technology/view-part?ref=eda>; AVAILABILITY: In Stock; CHECK_PRICES: https://www.snapeda.com/parts/SS54-HF/Comchip+Technology/view-part/?ref=eda; DESCRIPTION: Diode Schottky 40 V 5A Surface Mount DO-214AC (SMA); MF: Comchip Technology; MP: SS54-HF; PACKAGE: DO-214AC-214 Comchip Technology; PRICE: None; PURCHASE-URL: https://www.snapeda.com/api/url_track_click_mouser/?unipart_id=5812679&manufacturer=Comchip Technology&part_name=SS54-HF&search_term=ss54; SNAPEDA_LINK: https://www.snapeda.com/parts/SS54-HF/Comchip+Technology/view-part/?ref=snap
EC200_GSM = EC200UCNAB-N05-SNNSA:EC200UCNAB-N05-SNNSA: Check availability <https://pricing.snapeda.com/parts/EC200UCNAB-N05-SNNSA/Quectel/view-part?ref=eda>; AVAILABILITY: In Stock; CHECK_PRICES: https://www.snapeda.com/parts/EC200UCNAB-N05-SNNSA/Quectel/view-part/?ref=eda; DESCRIPTION: Quectel Wireless Solutions External Passive, 1559-1606, GNSS L1, Spiral, -, SMA Male (center pin), Terminal, 50 oe10; MF: Quectel; MP: EC200UCNAB-N05-SNNSA; PACKAGE: None; PRICE: None; SNAPEDA_LINK: https://www.snapeda.com/parts/EC200UCNAB-N05-SNNSA/Quectel/view-part/?ref=snap
GPIO PROG = Connector:PINHD-1X4: PIN HEADER; CATEGORY: Headers; DESCRIPTION: Header, Straight, 4 Position; MANUFACTURER: Generic; MPN: Generic; OPERATING_TEMPERATURE: Generic; PART_STATUS: Active; PITCH: 0.100" (2.54mm); ROHS_COMPLIANCE: Generic; SERIES: Generic; SUB-CATEGORY: Headers, Male Pins; TYPE: Board to Board or Cable, Unshrouded, Through Hole, Straight
GPS GSM = 1909763-1:1909763-1: VAO ITEM, MINI RF HEADER Check availability <https://pricing.snapeda.com/parts/1909763-1/TE%20Connectivity/view-part?ref=eda>; AVAILABILITY: In Stock; CHECK_PRICES: https://www.snapeda.com/parts/1909763-1/TE+Connectivity+AMP+Connectors/view-part/?ref=eda; COMMENT: 1909763-1; DESCRIPTION: U.FL (UMCC) Connector Jack, Male Pin 50 Ohms Surface Mount Solder; MF: TE Connectivity; MP: 1909763-1; PACKAGE: None; PRICE: None; PURCHASE-URL: https://www.snapeda.com/api/url_track_click_mouser/?unipart_id=380488&manufacturer=TE Connectivity&part_name=1909763-1&search_term=1909763; SNAPEDA_LINK: https://www.snapeda.com/parts/1909763-1/TE+Connectivity+AMP+Connectors/view-part/?ref=snap
H1-H4 = AQ_sensor_GSM:MOUNT-PAD-ROUND: MOUNTING PAD, round
J1 = AQ_sensor_GSM:F-1X03-: FEMALE HEADER
J2 = 53261-0871:53261-0871: Connector Header Surface Mount, Right Angle 8 position 0.049" (1.25mm) Check availability <https://pricing.snapeda.com/parts/53261-0871/Molex/view-part?ref=eda>; AVAILABILITY: In Stock; CHECK_PRICES: https://www.snapeda.com/parts/53261-0871/Molex/view-part/?ref=eda; DESCRIPTION: Conn; Rect/PCB; Header; 1.25mm Pitch; W2B; 8 Pos; PicoBlade; SMT; Rt Ang; Tin | Molex Incorporated 53261-0871; MF: Molex; MP: 53261-0871; PACKAGE: None; PRICE: None; SNAPEDA_LINK: https://www.snapeda.com/parts/53261-0871/Molex/view-part/?ref=snap
J3 = PJ-002BH:PJ-002BH: 2.5 mm Center Pin, 5.0 A, Right Angle, Through Hole, Dc Power Jack Connector Check availability <https://pricing.snapeda.com/parts/PJ-002BH/CUI%20Devices/view-part?ref=eda> Check availability <https://pricing.snapeda.com/parts/PJ-002BH/CUI%20Devices/view-part?ref=eda>; AVAILABILITY: In Stock; CHECK_PRICES: https://www.snapeda.com/parts/PJ-002BH/CUI+Devices/view-part/?ref=eda; CUI_PURCHASE_URL: https://www.cuidevices.com/product/interconnect/connectors/dc-power-connectors/jacks/pj-002bh?utm_source=snapeda.com&utm_medium=referral&utm_campaign=snapedaBOM; DESCRIPTION: 2.5 x 6.5 mm, 5.0 A, Horizontal, Through Hole, Dc Power Jack Connector; MF: CUI Devices; MP: PJ-002BH; PACKAGE: None; PRICE: None; PURCHASE-URL: https://www.snapeda.com/api/url_track_click_mouser/?unipart_id=329039&manufacturer=CUI Devices&part_name=PJ-002BH&search_term=dc power jack; SNAPEDA_LINK: https://www.snapeda.com/parts/PJ-002BH/CUI+Devices/view-part/?ref=snap
L1 = Fixed Inductors:784787047: Fixed Inductors WE-PD2SA SMD AECQ200 4.7uH 3.3A 29mOhm Manufacturer's datasheet <https://www.mouser.in/datasheet/2/445/784787047-1368852.pdf>; CREATED_BY: PCBLayout.com; MANUFACTURER: Wurth Elektronik; MPN: 784787047; PACKAGE: 7870
L2 = Fixed Inductors:784778010: FIXED IND 1UH 3.5A 36 MOHM SMD Manufacturer's datasheet <https://katalog.we-online.de/pbs/datasheet/784778010.pdf>; CREATED_BY: PCBLayout.com; DIGIKEY_PART_NUMBER: 732-6740-2-ND; MANUFACTURER: Wurth Electronics Inc.; MPN: 784778010; PACKAGE: 7332
MT2492 = MT2492:MT2492: The MT2492 is a fully integrated, high–efficiency 2A synchronous rectified step-down converter by Eng. Augustine.
PB_IN = AQ_sensor_GSM:10118192-0001LF: Single Port 5 Contact Horizontal Right Angle Shielded Micro B USB 2.0 Connector; AVAILABILITY: Unavailable; DESCRIPTION: USB - micro B USB 2.0 Receptacle Connector 5 Position Surface Mount, Right Angle; MF: Amphenol ICC; MP: 10118192-0001LF; PACKAGE: None; PRICE: None
Q2-Q7 = MMBT2222_:MMBT2222*: NPN Transistor Check availability <https://pricing.snapeda.com/parts/MMBT2222/ON%20Semiconductor/view-part?ref=eda>; AVAILABILITY: In Stock; CHECK_PRICES: https://www.snapeda.com/parts/MMBT2222/Onsemi/view-part/?ref=eda; DESCRIPTION: Bipolar (BJT) Transistor NPN 30 V 600 mA 250MHz 300 mW Surface Mount SOT-23-3 (TO-236); MF: ON Semiconductor; MP: MMBT2222; PACKAGE: SOT-23-3 Fairchild Semiconductor; PRICE: None; SNAPEDA_LINK: https://www.snapeda.com/parts/MMBT2222/Onsemi/view-part/?ref=snap
Q8 = FS8205:FS8205: Dual N Channel Enhancement Mode Power MOSFET Check availability <https://pricing.snapeda.com/parts/FS8205/Fortune%20Semiconductor/view-part?ref=eda>; AVAILABILITY: In Stock; CHECK_PRICES: https://www.snapeda.com/parts/FS8205/Fortune+Semiconductor/view-part/?ref=eda; DESCRIPTION: Dual N-Channel Enhancement Mode Power MOSFET; MF: Fortune Semiconductor; MP: FS8205; PACKAGE: Package; PRICE: None; SNAPEDA_LINK: https://www.snapeda.com/parts/FS8205/Fortune+Semiconductor/view-part/?ref=snap
R1-R3 R6-R10 R17 R19 R20 R37 = SparkFun-Resistors:1.20KOHM: 1.20kΩ resistor A resistor is a passive two-terminal electrical component that implements electrical resistance as a circuit element. Resistors act to reduce current flow, and, at the same time, act to lower voltage levels within circuits. - Wikipedia; PROD_ID: RES-08413; VALUE: 1.20k
SIMCARD = 78646-3001:78646-3001: Conn Micro SIM Card SKT 6 POS 2.54mm Solder RA SMD 0.5A/Contact Embossed T/R Check availability <https://pricing.snapeda.com/parts/78646-3001/Molex/view-part?ref=eda>; AVAILABILITY: In Stock; CHECK_PRICES: https://www.snapeda.com/parts/78646-3001/Molex/view-part/?ref=eda; DESCRIPTION: Horizontal Surface Mount Micro SIM Card Connector, with Push In Termination | Molex Incorporated 78646-3001; MF: Molex; MP: 78646-3001; PACKAGE: None; PRICE: None; PURCHASE-URL: https://www.snapeda.com/api/url_track_click_mouser/?unipart_id=75189&manufacturer=Molex&part_name=78646-3001&search_term= 786463001; SNAPEDA_LINK: https://www.snapeda.com/parts/78646-3001/Molex/view-part/?ref=snap
SV1 SV2 = AQ_sensor_GSM:FE15-1: FEMALE HEADER; OC_FARNELL: unknown; OC_NEWARK: unknown
U1 = DW01-P:DW01-P: Check availability <https://pricing.snapeda.com/parts/DW01-P/Fortune/view-part?ref=eda>; AVAILABILITY: In Stock; CHECK_PRICES: https://www.snapeda.com/parts/DW01-P/Fortune+Semiconductor/view-part/?ref=eda; DESCRIPTION: One Cell Lithium-ion/Polymer Battery Protection IC; MF: Fortune; MP: DW01-P; PACKAGE: None; PRICE: None; SNAPEDA_LINK: https://www.snapeda.com/parts/DW01-P/Fortune+Semiconductor/view-part/?ref=snap
U3 = AQ_sensor_GSM:TEXAS_INSTRUMENTS_LM1117IMP-3.3-NOPB: PM-REG-LM1086-SOT4; CIIVA_IDS: 19361124; CODE__IPC: SOT223-4; CODE__JEDEC: TO-261-AA; COMPONENT_LINK_1_DESCRIPTION: Datasheet URL; COMPONENT_LINK_1_URL: http://www.ti.com/general/docs/lit/getliterature.tsp?genericPartNumber=LM1117-N&fileType=pdf; COMP_TYPE: LDO IC; FOOTPRINT_VARIANT_NAME_0: Level C; FOOTPRINT_VARIANT_NAME_1: Level B; FOOTPRINT_VARIANT_NAME_2: Level A; HIGH__RELIABILITY: Y; IMPORTED: yes; IMPORTED_FROM: vault; IMPORT_TS: 1521845365; MF: Texas Instruments; MPN: LM1117IMP-3.3/NOPB; PACKAGE: DCY0004A; PACKAGE_DESCRIPTION: Molded SOT-223, 6.50 x 3.56 x 1.6mm Body, 4 Lead, 2.3mm Pitch; PACKAGE_TOP_MARKING: XYTT*N05B; PIN_COUNT: 4; POWER_WISE: N; PREFIX: U; RELEASE_DATE: 1464077430; ROHS: Yes; VAULT_GUID: 7E820BF6-F141-44C1-8A74-392CB201F257; VAULT_REVISION: 16019014-2FBF-4157-ADF5-B132B4DC413A
U5 = TXS0108EPWR:TXS0108EPWR: Check availability <https://pricing.snapeda.com/parts/TXS0108EPWR/Texas%20Instruments/view-part?ref=eda>; AVAILABILITY: In Stock; CHECK_PRICES: https://www.snapeda.com/parts/TXS0108EPWR/Texas+Instruments/view-part/?ref=eda; DESCRIPTION: 8-bit bidirectional voltage-level shifter for open-drain and push-pull application; MF: Texas Instruments; MP: TXS0108EPWR; PACKAGE: TSSOP-20 Texas Instruments; PRICE: None; PURCHASE-URL: https://www.snapeda.com/api/url_track_click_mouser/?unipart_id=105750&manufacturer=Texas Instruments&part_name=TXS0108EPWR&search_term=txs0108epwr; SNAPEDA_LINK: https://www.snapeda.com/parts/TXS0108EPWR/Texas+Instruments/view-part/?ref=snap
U$2 = IP5306:IP5306: IP5306 2.1A Charging 2.4 A Highly integrated mobile power discharge SOC by Eng. Augustine.

## Net classes
0 default: width 0.2 mm, drill 0.2 mm, clearance 0.2 mm
1 POWER: width 0.4 mm, drill 0.2 mm, clearance 0.2 mm to class 0, clearance 0.2 mm
2 BGA: width 0.2 mm, drill 0.2 mm
3 HCurrent: width 0.4 mm, drill 0.2 mm, clearance 0.2 mm to class 0

## Board
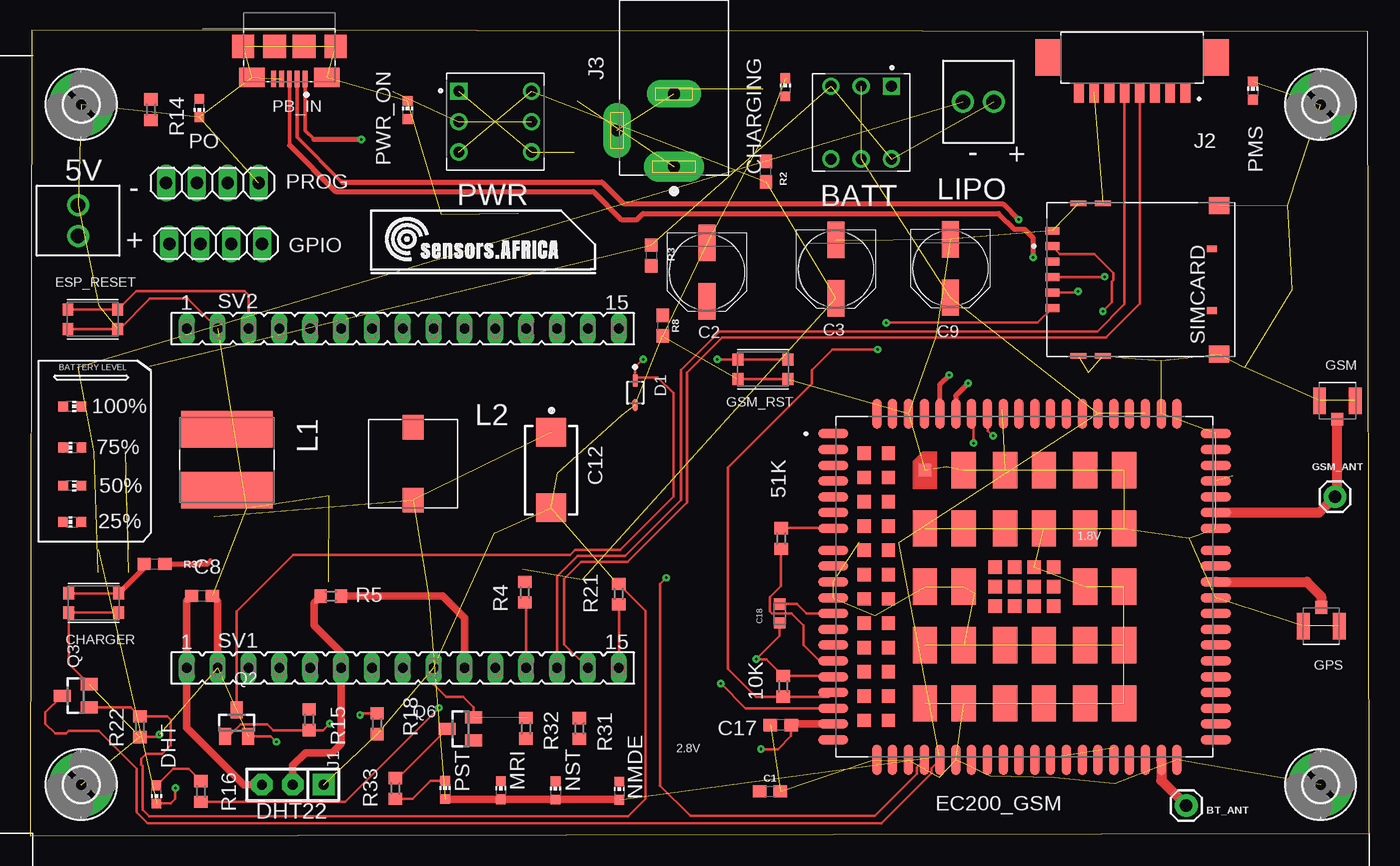
[diagram p5: board, top side]
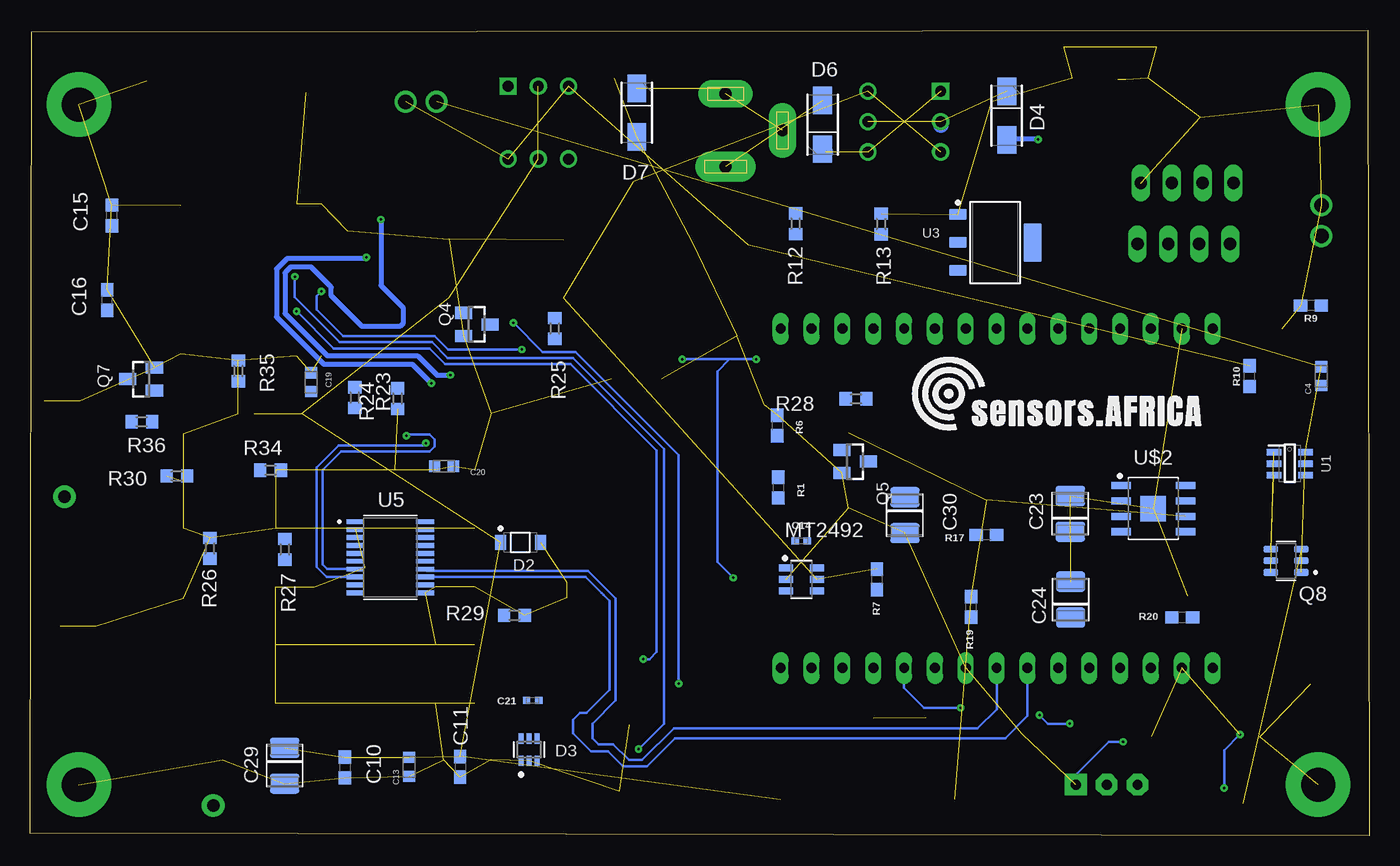
[diagram p6: board, bottom side, seen from below]

Size 110.2 x 66.3 mm. Coordinates in mm from the lower left corner, seen from the top.
Outline: 110.1,66.2 0.1,66.3 0,0 110.2,0.2 110.1,66.2
Copper layers (1*16): Top 0.035mm / dielectric 1.5mm / Bottom 0.035mm
Design rules "default *": minimum track width 0.1mm, minimum drill 0.15mm, track to track 0.3mm, track to pad 0.1mm, pad to pad 0.2mm, via to via 0.3mm, smd to smd 0.3mm, copper to edge 0.3mm, drill to drill 0.3mm, minimum pad ring 10mil, minimum via ring 8mil, stop-mask expansion 4mil, vias tented up to drill 0mil, thermal gap 10mil

### Footprints (pad centres in the part's own frame; a part is rotated, then mirrored left to right if it is on the bottom)
TERMBLK_254-2N = drill 1.2: 1 0,0; 2 2.54,0
R0603 = smd 1 x 1.1: 1 -0.85,0; 2 0.85,0
CHIP-LED0603 = smd 0.8 x 0.8: A 0,-0.75; C 0,0.75
SW_TL2285EE = drill 0.9 square: 1 -2.5,-3 | drill 0.9: 2 0,-3; 3 2.5,-3; 4 -2.5,3; 5 0,3; 6 2.5,3
1X01 = drill 1.016 pad 1.88: 1 0,0
0603 = smd 1.1 x 1: 1 -0.85,0; 2 0.85,0
PANASONIC_D = smd 3 x 1.4: + 2.4,0; - -2.4,0
CAPC1608X90N = smd 0.92 x 0.98: 1 -0.775,0; 2 0.775,0
C0603 = smd 1.1 x 1: 1 -0.85,0; 2 0.85,0
CAPMP7343X430N = smd 2.35 x 2.45: 1 -3.1,0; 2 3.1,0
0402-TIGHT = smd 0.6 x 0.6: 1 -0.5,0; 2 0.5,0
CAP_TANT_B = smd 1.66 x 2.42: 1 -1.475,0; 2 1.475,0
SW_KMR621NGLFS = smd 0.9 x 1: 1_1 -2.05,0.8; 1_2 2.05,0.8; 2_1 -2.05,-0.8; 2_2 2.05,-0.8
ON_SEMI_1N4148WS_0 = smd 1.006 x 0.392: 1 -1,0; 2 1,0
ON_SEMICONDUCTOR_MMSZ5231BT1G_0 = smd 0.91 x 1.22: 1 -1.635,0; 2 1.635,0
SEMTECH_SMF05C_0 = smd 0.85 x 0.4: 1 -0.925,0.65; 2 -0.925,0; 3 -0.925,-0.65; 4 0.925,-0.65; 5 0.925,0; 6 0.925,0.65
DIOM5025X220N = smd 2.25 x 1.55: 1 -2,0; 2 2,0
XCVR_EC200UCNAB-N05-SNNSA = smd 2.5 x 0.8: 1 -15.75,12.6; 2 -15.75,11.3; 3 -15.75,10; 4 -15.75,8.7; 5 -15.75,7.4; 6 -15.75,6.1; 7 -15.75,4.8; 8 -15.75,0.4; 9 -15.75,-0.9; 10 -15.75,-2.2; 11 -15.75,-3.5; 12 -15.75,-4.8; 13 -15.75,-6.1; 14 -15.75,-7.4; 15 -15.75,-8.7; 16 -15.75,-10; 17 -15.75,-11.3; 18 -15.75,-12.6; 37 15.75,-12.6; 38 15.75,-11.3; 39 15.75,-10; 40 15.75,-8.7; 41 15.75,-7.4; 42 15.75,-6.1; 43 15.75,-4.8; 44 15.75,-3.5; 45 15.75,-2.2; 46 15.75,-0.9; 47 15.75,0.4; 48 15.75,4.8; 49 15.75,6.1; 50 15.75,7.4; 51 15.75,8.7; 52 15.75,10; 53 15.75,11.3; 54 15.75,12.6; 141 -15.75,3; 142 -15.75,1.7; 143 15.75,1.7; 144 15.75,3 | smd 0.8 x 2.5: 19 -9.55,-14.25; 20 -8.25,-14.25; 21 -6.95,-14.25; 22 -5.65,-14.25; 23 -4.35,-14.25; 24 -3.05,-14.25; 25 -1.75,-14.25; 26 -0.45,-14.25; 27 0.85,-14.25; 28 2.15,-14.25; 29 3.45,-14.25; 30 4.75,-14.25; 31 6.05,-14.25; 32 7.35,-14.25; 33 8.65,-14.25; 34 9.95,-14.25; 35 11.25,-14.25; 36 12.55,-14.25; 55 12.55,14.25; 56 11.25,14.25; 57 9.95,14.25; 58 8.65,14.25; 59 7.35,14.25; 60 6.05,14.25; 61 4.75,14.25; 62 3.45,14.25; 63 2.15,14.25; 64 0.85,14.25; 65 -0.45,14.25; 66 -1.75,14.25; 67 -3.05,14.25; 68 -4.35,14.25; 69 -5.65,14.25; 70 -6.95,14.25; 71 -8.25,14.25; 72 -9.55,14.25; 113 -10.85,14.25; 114 -12.15,14.25; 115 -10.85,-14.25; 116 -12.15,-14.25 | smd 1.1 x 1.1: 73 2.4,1.6; 74 2.4,0; 75 2.4,-1.6; 76 0.8,1.6; 77 0.8,0; 78 0.8,-1.6; 79 -0.8,1.6; 80 -0.8,0; 81 -0.8,-1.6; 82 -2.4,1.6; 83 -2.4,0; 84 -2.4,-1.6; 117 -11.2,11; 118 -11.2,9; 119 -11.2,7; 120 -11.2,5; 121 -11.2,3; 122 -11.2,1; 123 -11.2,-1; 124 -11.2,-3; 125 -11.2,-5; 126 -11.2,-7; 127 -11.2,-9; 128 -11.2,-11; 129 -13.2,11; 130 -13.2,9; 131 -13.2,7; 132 -13.2,5; 133 -13.2,3; 134 -13.2,1; 135 -13.2,-1; 136 -13.2,-3; 137 -13.2,-5; 138 -13.2,-7; 139 -13.2,-9; 140 -13.2,-11 | smd 2 x 3: 85 8.2,9.6; 86 8.2,4.8; 87 8.2,0; 88 8.2,-4.8; 89 8.2,-9.6; 90 5,9.6; 91 5,4.8; 92 5,0; 93 5,-4.8; 94 5,-9.6; 95 1.6,9.6; 96 1.6,4.8; 97 1.6,-4.8; 98 1.6,-9.6; 99 -1.6,9.6; 100 -1.6,4.8; 101 -1.6,-4.8; 102 -1.6,-9.6; 103 -5,9.6; 104 -5,4.8; 105 -5,0; 106 -5,-4.8; 107 -5,-9.6; 109 -8.2,4.8; 110 -8.2,0; 111 -8.2,-4.8; 112 -8.2,-9.6 | smd 1 x 1: 108 -8.2,9.6
1X04 = drill 1.016 long: 1 -3.81,0; 2 -1.27,0; 3 1.27,0; 4 3.81,0
TE_1909763-1 = smd 1 x 1.05: 1 0,-1.525 | smd 1.05 x 2.2: 2 -1.475,0; 3 1.475,0
2,8-PAD = drill 2.8 pad 5.334: B2,8 0,0
SIP-100-03-32 = drill 0.813 pad 1.778 square: 1 -2.54,0 | drill 0.813 pad 1.778 octagon: 2 0,0; 3 2.54,0
MOLEX_53261-0871 = smd 0.8 x 1.6: 1 -4.375,2.9; 2 -3.125,2.9; 3 -1.875,2.9; 4 -0.625,2.9; 5 0.625,2.9; 6 1.875,2.9; 7 3.125,2.9; 8 4.375,2.9 | smd 2.1 x 3: S1 -6.925,0; S2 6.925,0
CUI_PJ-002BH = drill 1 pad 2.5 long: 1 0,0 | drill 1 pad 2.25 long: 2 6,0; 3 3,4.7
784787047 = smd 7.5 x 3: 1 0,2.5; 2 0,-2.5
784778010 = smd 1.7 x 2: 1 0,3; 2 0,-3
SOT95P280X145-6N = smd 1.172 x 0.589: 1 -1.272,0.95; 2 -1.272,0; 3 -1.272,-0.95; 4 1.272,-0.95; 5 1.272,0; 6 1.272,0.95
AMPHENOL_10118192-0001LF = smd 0.4 x 1.35: 1 -1.3,0; 2 -0.65,0; 3 0,0; 4 0.65,0; 5 1.3,0 | smd 2.1 x 1.6: SH1 -3.1,-0.125; SH2 3.1,-0.125 | smd 1.8 x 1.9: SH3 -3.8,-2.675; SH6 3.8,-2.675 | smd 1.9 x 1.9: SH4 -1.2,-2.675; SH5 1.2,-2.675
SOT23-BEC = smd 1 x 1.4: B -0.95,-1.1; C 0,1.1; E 0.95,-1.1
SOT95P280X145-6N' = smd 1.21 x 0.59: 1 -1.255,0.95; 2 -1.255,0; 3 -1.255,-0.95; 4 1.255,-0.95; 5 1.255,0; 6 1.255,0.95
MOLEX_78646-3001 = smd 1.15 x 0.65: C1 -7.295,2.755; C2 -7.295,0.215; C3 -7.295,-2.325; C5 -7.295,4.025; C6 -7.295,1.485; C7 -7.295,-1.055 | smd 1.3 x 0.45: G1 -5.125,6.27; G2 -3.125,6.27; G3 -5.125,-6.27; G4 -3.125,-6.27 | smd 1.7 x 1.4: G5 6.435,-6.105; G6 6.435,6.105 | smd 0.8 x 0.54: X1 5.855,2.54; X2 5.855,-2.54
FE15 = drill 0.813 long: 1 -17.78,0; 2 -15.24,0; 3 -12.7,0; 4 -10.16,0; 5 -7.62,0; 6 -5.08,0; 7 -2.54,0; 8 0,0; 9 2.54,0; 10 5.08,0; 11 7.62,0; 12 10.16,0; 13 12.7,0; 14 15.24,0; 15 17.78,0
SOT23-6L = smd 0.55 x 1.2: 1 -0.95,-1.3; 2 0,-1.3; 3 0.95,-1.3; 4 0.95,1.3; 5 0,1.3; 6 -0.95,1.3
TEXAS_INSTRUMENTS_LM1117IMP-3.3-NOPB_0 = smd 1.45 x 0.9: 1 -3.075,2.3; 2 -3.075,0; 3 -3.075,-2.3 | smd 1.45 x 3.15: 4 3.075,0
SOP65P640X120-20N = smd 1.57 x 0.41: 1 -2.87,2.925; 2 -2.87,2.275; 3 -2.87,1.625; 4 -2.87,0.975; 5 -2.87,0.325; 6 -2.87,-0.325; 7 -2.87,-0.975; 8 -2.87,-1.625; 9 -2.87,-2.275; 10 -2.87,-2.925; 11 2.87,-2.925; 12 2.87,-2.275; 13 2.87,-1.625; 14 2.87,-0.975; 15 2.87,-0.325; 16 2.87,0.325; 17 2.87,0.975; 18 2.87,1.625; 19 2.87,2.275; 20 2.87,2.925
SOIC127P600X165-9T209N = smd 1.609 x 0.594: 1 -2.653,1.905; 2 -2.653,0.635; 3 -2.653,-0.635; 4 -2.653,-1.905; 5 2.653,-1.905; 6 2.653,-0.635; 7 2.653,0.635; 8 2.653,1.905 | smd 2.09 x 2.09: 9 0,0

### Placement (x,y rotation side)
5V  3.93,49.37 90 top
10K  61.97,12.29 90 top
25%  3.44,25.83 90 top
50%  3.46,28.8 270 top
51K  61.79,24.46 90 top
75%  3.46,31.96 90 top
100%  3.46,35.34 270 top
BATT  68.39,58.71 180 top
BT_ANT  95.14,2.48 180 top
C1  60.88,3.64 0 top
C2  55.68,46.39 270 top
C3  66.3,46.65 270 top
C4  3.94,37.82 90 bottom
C8  14.13,19.74 0 top
C9  75.72,46.7 270 top
C10  84.31,5.61 270 bottom
C11  74.82,5.66 270 bottom
C12  42.85,30.1 270 top
C13  79.03,5.67 90 bottom
C14  46.75,24.27 0 bottom
C15  103.49,51.07 90 bottom
C16  103.87,44.09 90 bottom
C17  61.77,9.1 180 top
C18  61.68,18.29 270 top
C19  87.08,37.33 270 bottom
C20  76.16,30.41 180 bottom
C21  68.86,11.15 0 bottom
C23  24.6,26.49 90 bottom
C24  24.57,19.43 90 bottom
C29  89.27,5.75 270 bottom
C30  38.21,26.39 270 bottom
CHARGER  5.22,19.16 0 top
CHARGING  62.14,61.62 0 top
D1  49.79,36.47 270 top
D2  69.86,24.14 0 bottom
D3  69.15,7.08 90 bottom
D4  29.82,59.28 270 bottom
D6  44.99,58.52 90 bottom
D7  60.29,59.52 270 bottom
DHT  10.39,3.4 180 top
EC200_GSM  81.83,20.49 0 top
ESP_RESET  5.14,42.52 180 top
GPIO  15.25,48.73 0 top
GPS  106.26,17.26 180 top
GSM  107.59,35.81 0 top
GSM_ANT  107.39,27.9 180 top
GSM_RST  60.31,38.4 180 top
H1  4.2,60.2 180 top
H2  4.2,4.2 180 top
H3  106.2,4.2 180 top
H4  106.2,60.2 180 top
J1  21.6,4.2 180 top
J2  90.69,64.06 180 top
J3  52.98,55.07 90 top
L1  16.18,30.94 180 top
L2  31.51,30.62 0 top
LIPO  79.31,60.42 180 top
MRI  38.73,3.75 0 top
MT2492  46.73,21.1 0 bottom
NMDE  48.47,3.69 0 top
NST  43.22,3.73 0 top
PB_IN  21.32,62.3 180 top
PMS  100.63,61.35 0 top
PO  13.91,59.91 180 top
PROG  14.98,53.74 0 top
PST  34.13,3.76 0 top
PWR  38.27,58.79 270 top
PWR_ON  31.05,59.73 0 top
Q2  16.98,9.28 0 top
Q3  3.73,11.52 90 top
Q4  73.45,42.09 270 bottom
Q5  42.31,30.8 270 bottom
Q6  35.4,8.79 90 top
Q7  101.09,37.58 90 bottom
Q8  FS8205  [SOT95P280X145-6N']  6.84,22.62 180 bottom
R1  48.63,28.66 270 bottom
R2  60.54,54.67 90 top
R3  51.1,47.77 270 top
R4  40.71,20.04 270 top
R5  24.74,19.72 180 top
R6  48.72,33.77 270 bottom
R7  40.5,21.09 90 bottom
R8  52.05,41.99 270 top
R9  4.79,43.65 180 bottom
R10  9.84,37.82 90 bottom
R12  47.21,50.39 270 bottom
R13  40.16,50.36 270 bottom
R14  9.93,59.76 270 top
R15  22.94,9.54 270 top
R16  14.05,3.65 270 top
R17  31.51,24.76 180 bottom
R18  28.54,9.21 90 top
R19  32.76,18.83 90 bottom
R20  15.39,17.98 0 bottom
R21  48.42,19.88 90 top
R22  9.02,8.96 90 top
R23  83.5,36.07 90 bottom
R24  79.98,35.98 90 bottom
R25  67.03,41.76 270 bottom
R26  95.41,23.66 90 bottom
R27  89.25,23.57 270 bottom
R28  42.24,35.96 180 bottom
R29  70.35,18.13 0 bottom
R30  98.14,29.61 180 bottom
R31  45.2,8.82 270 top
R32  40.8,8.84 270 top
R33  30.03,3.89 270 top
R34  90.43,30.08 180 bottom
R35  93.09,38.26 270 bottom
R36  101.02,34.07 0 bottom
R37  10.22,22.36 0 top
SIMCARD  91.4,45.77 0 top
SV1  30.66,13.8 0 top
SV2  30.66,41.74 0 top
U1  6.54,30.62 270 bottom
U3  30.77,48.83 0 bottom
U5  80.58,22.92 0 bottom
U$2  17.77,26.92 0 bottom

### Tracks (layer width: path | path; a pad name or v marks a point on that pad's centre or on a via)
4.5-16V  (5 unrouted)
5VT  (2 unrouted)
  Bottom 1.27: 35.27,58.51 PWR.2
+3V3
  Top 0.6: C8.1 12.88,19.34 SV1.1 12.88,8.88 17.56,4.2 J1.3 | R5.1 33.94,19.72 35.74,17.92 SV1.10
BATT-  (3 unrouted)
BT_ANT
  Top 0.813: EC200_GSM.35 93.08,4.54 BT_ANT.1
DHT_LED  (via drill 0.2)
  Top 0.2: R16.2 25.91,2.8 v33.64,10.52
  Bottom 0.2: v33.64,10.52 36.64,10.52 38.28,12.16 SV1.11
DHT_OUT
  Top 0.6: R5.2 23.34,19.17 23.34,17.32 25.58,15.08 SV1.6 25.58,7.56 24.84,6.82 22.64,6.82 21.6,5.78 J1.2
  Bottom 0.2: 25.61,13.83 SV1.6
ESP_RST
  Top 0.2: SV2.3 17.96,44.5 17.64,44.82 8.7,44.82 7.27,43.39 ESP_RESET.2_1 ESP_RESET.2_2
G_USB_D+  (via drill 0.2)
  Top 0.305: PB_IN.3 21.32,56.84
  Top 0.4: v82.54,47.62 82.54,49.22 81.84,49.92 81.01,49.92 79.7,51.22 50.44,51.22 49.94,50.72 48.64,50.72 46.34,53.02 25.14,53.02 21.32,56.84 | v77.21,37.25 76.18,36.23 EC200_GSM.69
  Bottom 0.4: v77.21,37.25 78.77,38.82 86.06,38.82 89.94,42.71 89.94,46.65 89.06,47.53 82.64,47.53 v82.54,47.62
G_USB_D-  (via drill 0.2)
  Top 0.305: PB_IN.2 21.97,57.49 25.64,53.82
  Top 0.4: 25.64,53.82 47.04,53.82 48.84,52.02 80.04,52.02 v81.34,50.72 | EC200_GSM.70 74.88,37.16 v75.64,37.92
  Bottom 0.4: v81.34,50.72 81.34,45.29 79.54,43.49 79.54,42.16 79.77,41.92 82.9,41.92 85.44,44.45 85.44,45.16 87.11,46.83 88.77,46.83 89.24,46.36 89.24,43 85.77,39.52 78.34,39.52 76.74,37.92 v75.64,37.92
GND  (via drill 0.2)  (119 unrouted)
  Top 0.2: SV1.9 33.2,12.46 34.24,11.42 35.64,11.42 36.5,10.56 Q6.E | Q3.E 3.17,14.13 CHARGER.2_1 CHARGER.2_2 | R22.1 10.43,8.12 v10.64,8.32 | v11.94,3.92 11.94,3.02 11.57,2.65 DHT.C | Q2.E 19.78,8.18 v20.24,7.72 | SV2.2 12.94,44.22 9.84,44.22 7.34,41.72 ESP_RESET.1_1 ESP_RESET.1_2 | GSM_RST.1_1 GSM_RST.1_2
  Top 0.6: C8.2 15.42,19.3 SV1.2
  Bottom 0.2: v10.64,8.32 11.94,7.02 v11.94,3.92 | v20.24,7.72 21.44,7.72 24.14,5.02 J1.1
GNSS_ANT
  Top 0.813: EC200_GSM.47 105.07,20.89 106.26,19.7 GPS.1
GSM_ANT
  Top 0.813: EC200_GSM.49 106.08,26.59 GSM_ANT.1 107.59,28.1 GSM.1
GSM_RST  (via drill 0.2)
  Top 0.2: EC200_GSM.20 72.98,5.64 72.98,5.1 69.5,1.62 54.34,1.62 51.84,4.12 51.84,20.72 v52.34,21.22 | 49.79,37.72 D1.1 | v56.54,39.22 56.56,39.2 GSM_RST.2_2 GSM_RST.2_1 | Q2.C 16.98,18.47 21.64,23.12 44.43,23.12 44.83,23.52 48.54,23.52 52.94,27.92 52.94,36.42 51.64,37.72 49.79,37.72 | v50.44,39.22 49.79,38.57 49.79,37.72
  Bottom 0.2: v52.34,21.22 53.64,22.52 53.64,38.22 52.64,39.22 | 52.64,39.22 51.74,39.22 v50.44,39.22 | v56.54,39.22 52.64,39.22
LBV  (4 unrouted)
MAIN_RXD  (via drill 0.2)
  Top 0.2: v77.64,32.32 77.64,34.58 EC200_GSM.68
  Bottom 0.2: U5.8 85.81,21.29 86.64,22.12 86.64,30.32 84.84,32.12 77.84,32.12 v77.64,32.32
MAIN_TXD  (via drill 0.2)
  Top 0.2: EC200_GSM.67 78.84,34.68 78.84,33.32 v79.24,32.92
  Bottom 0.2: U5.7 85.75,21.94 86.14,22.33 86.14,30.12 84.63,31.62 77.35,31.62 76.94,32.03 76.94,32.61 77.35,33.03 79.14,33.03 v79.24,32.92
MCU_RXD
  Bottom 0.2: U5.14 77.56,21.8 64.31,21.8 62.04,19.53 62.04,11.12 63.94,9.22 63.94,8.02 63.44,7.52 62.24,7.52 60.94,6.22 59.84,6.22 57.24,8.82 32.24,8.82 30.66,10.4 SV1.8
MCU_TXD
  Bottom 0.2: U5.13 64.51,21.29 63.19,19.97 63.04,19.82 62.54,19.32 62.54,12.02 64.44,10.12 64.94,10.12 65.54,9.52 65.54,8.42 64.04,6.92 62.64,6.92 61.44,5.72 59.44,5.72 57.14,8.02 29.94,8.02 28.12,9.84 SV1.7
N$1  (via drill 0.2)
  Top 0.2: Q2.B 16.31,8.18 17.31,9.18 19.49,9.18 19.98,8.69 R15.2 24.1,8.69 v24.64,9.22 | v27.14,9.92 27.27,10.06 R18.2
  Bottom 0.2: v24.64,9.22 26.44,9.22 v27.14,9.92
N$2
  Top 0.2: Q3.B 8.26,10.57 R22.2 11.25,9.82 11.54,9.52 11.54,7.42 10.84,6.72 9.54,6.72 9.14,6.32 9.14,5.83 9.24,5.73 9.24,2.13 9.79,1.58 49.19,1.58 50.64,3.02 50.64,18.51 R21.2
N$9  (1 unrouted)
N$19  (1 unrouted)
N$20
  Top 0.2: CHARGER.1_2 CHARGER.1_1
  Top 0.4: CHARGER.1_2 9.37,22.06 R37.1
N$27
  Top 0.2: DHT.A 11.76,5.52 13.04,5.52 R16.1
N$32
  Top 0.2: Q6.C 30.25,4.74 R33.1
N$39
  Top 0.2: R33.2 31.46,3.04 32.93,4.51 PST.C
N$45
  Top 0.4: R37.2 14.57,22.36 14.84,22.62
N$59  (via drill 0.2)
  Top 0.305: PB_IN.1 22.62,58.04 23.34,57.32
  Top 0.4: 23.34,57.32 v27.24,57.32
  Bottom 0.4: v27.24,57.32 29.78,57.32 D4.2
N$60  (2 unrouted)
  Bottom 1.27: 53.42,61.52 J3.2
N$61  (1 unrouted)
PMS_LED
  Top 0.2: SV1.12 40.82,19.09 R4.2
PMS_RX
  Top 0.2: J2.5 90.06,43.75 87.84,41.52 56.74,41.52 53.54,38.32 53.54,27.62 48.94,23.02 45.04,23.02 43.36,21.34 SV1.13
PMS_TX
  Top 0.2: J2.4 91.31,43.79 88.55,41.02 56.95,41.02 54.04,38.12 54.04,27.42 49.15,22.52 45.34,22.52 43.94,21.12 43.94,15.76 SV1.14
PWRKEY
  Top 0.2: EC200_GSM.21 74.18,5.54 74.18,5.14 70.06,1.02 9.64,1.02 8.74,1.92 8.74,5.52 5.64,8.62 3.14,8.62 2.94,8.42 2.04,8.42 1.24,9.22 1.24,10.13 Q3.C
PWRKEY_0
  Top 0.2: SV1.15 48.44,19.02 R21.1
SIMCLK  (via drill 0.2)
  Top 0.2: SIMCARD.C3 82.89,42.23 v70.44,42.23 | v56.84,12.52 58.87,10.49 EC200_GSM.16
  Bottom 0.2: v70.44,42.23 68.04,39.82 65.33,39.82 56.84,31.33 v56.84,12.52
SIMDATA  (via drill 0.2)
  Top 0.2: EC200_GSM.15 65.73,11.44 10K.1 59.72,11.44 57.44,13.72 57.44,30.32 64.34,37.22 64.34,38.32 66.04,40.03 v69.74,40.03 | SIMCARD.C7 86.13,44.72 v86.24,44.82
  Bottom 0.2: v86.24,44.82 86.64,44.42 86.64,43.32 84.44,41.12 76.93,41.12 75.83,40.03 v69.74,40.03
SIMRST  (via drill 0.2)
  Top 0.2: SIMCARD.C2 88.4,45.99 v88.44,46.02 | v60.14,7.12 61.54,7.12 62.62,8.2 C17.1
  Top 0.6: EC200_GSM.17 62.7,9.19 C17.1
  Bottom 0.2: v88.44,46.02 88.44,44.32 84.74,40.62 77.14,40.62 75.84,39.32 65.54,39.32 58.04,31.82 58.04,9.22 v60.14,7.12
USIM_DET
  Top 0.2: 51K.1 61.79,20.55 60.89,19.65 60.89,18.48 61.07,18.3 62.66,18.3 63.64,17.32 63.64,15.72 64.97,14.39 EC200_GSM.13
USIM_GND
  Top 0.2: C18.1 63.1,19.06 63.87,18.29 EC200_GSM.10
USIM_VDD  (via drill 0.2)
  Top 0.2: SIMCARD.C1 84.75,47.88 87.57,47.88 89.14,46.31 89.14,45.73 89.04,45.63 89.04,43.93 v88.29,43.18 | EC200_GSM.14 65.57,13.09 65.52,13.14 10K.2 60.59,14.52 v59.74,14.52 61.68,16.46 C18.2
  Bottom 0.2: v88.29,43.18 85.23,40.12 77.35,40.12 76.05,38.82 65.75,38.82 58.64,31.72 58.64,15.12 59.24,14.52 v59.74,14.52
V_LIPO  (16 unrouted)
  Top 0.6: PST.A 38.71,3.01 MRI.A 43.2,3 NST.A 48.44,2.98 NMDE.A
VDD_EXT
  Top 0.2: 51K.2 66.06,25.31 EC200_GSM.7
VUSB  (2 unrouted)
  Bottom 1.27: D6.1 44.76,56.29
(copper drawn outside any net)
  shapes: Top area x1

### Text on the board
tPlace: - | + | - | + | BATTERY LEVEL
tNames: 1.8V | 2.8V | DHT22